# EAGLE design v.0.0.0 (EAGLE 5.11)

## Sheet 1 of 7
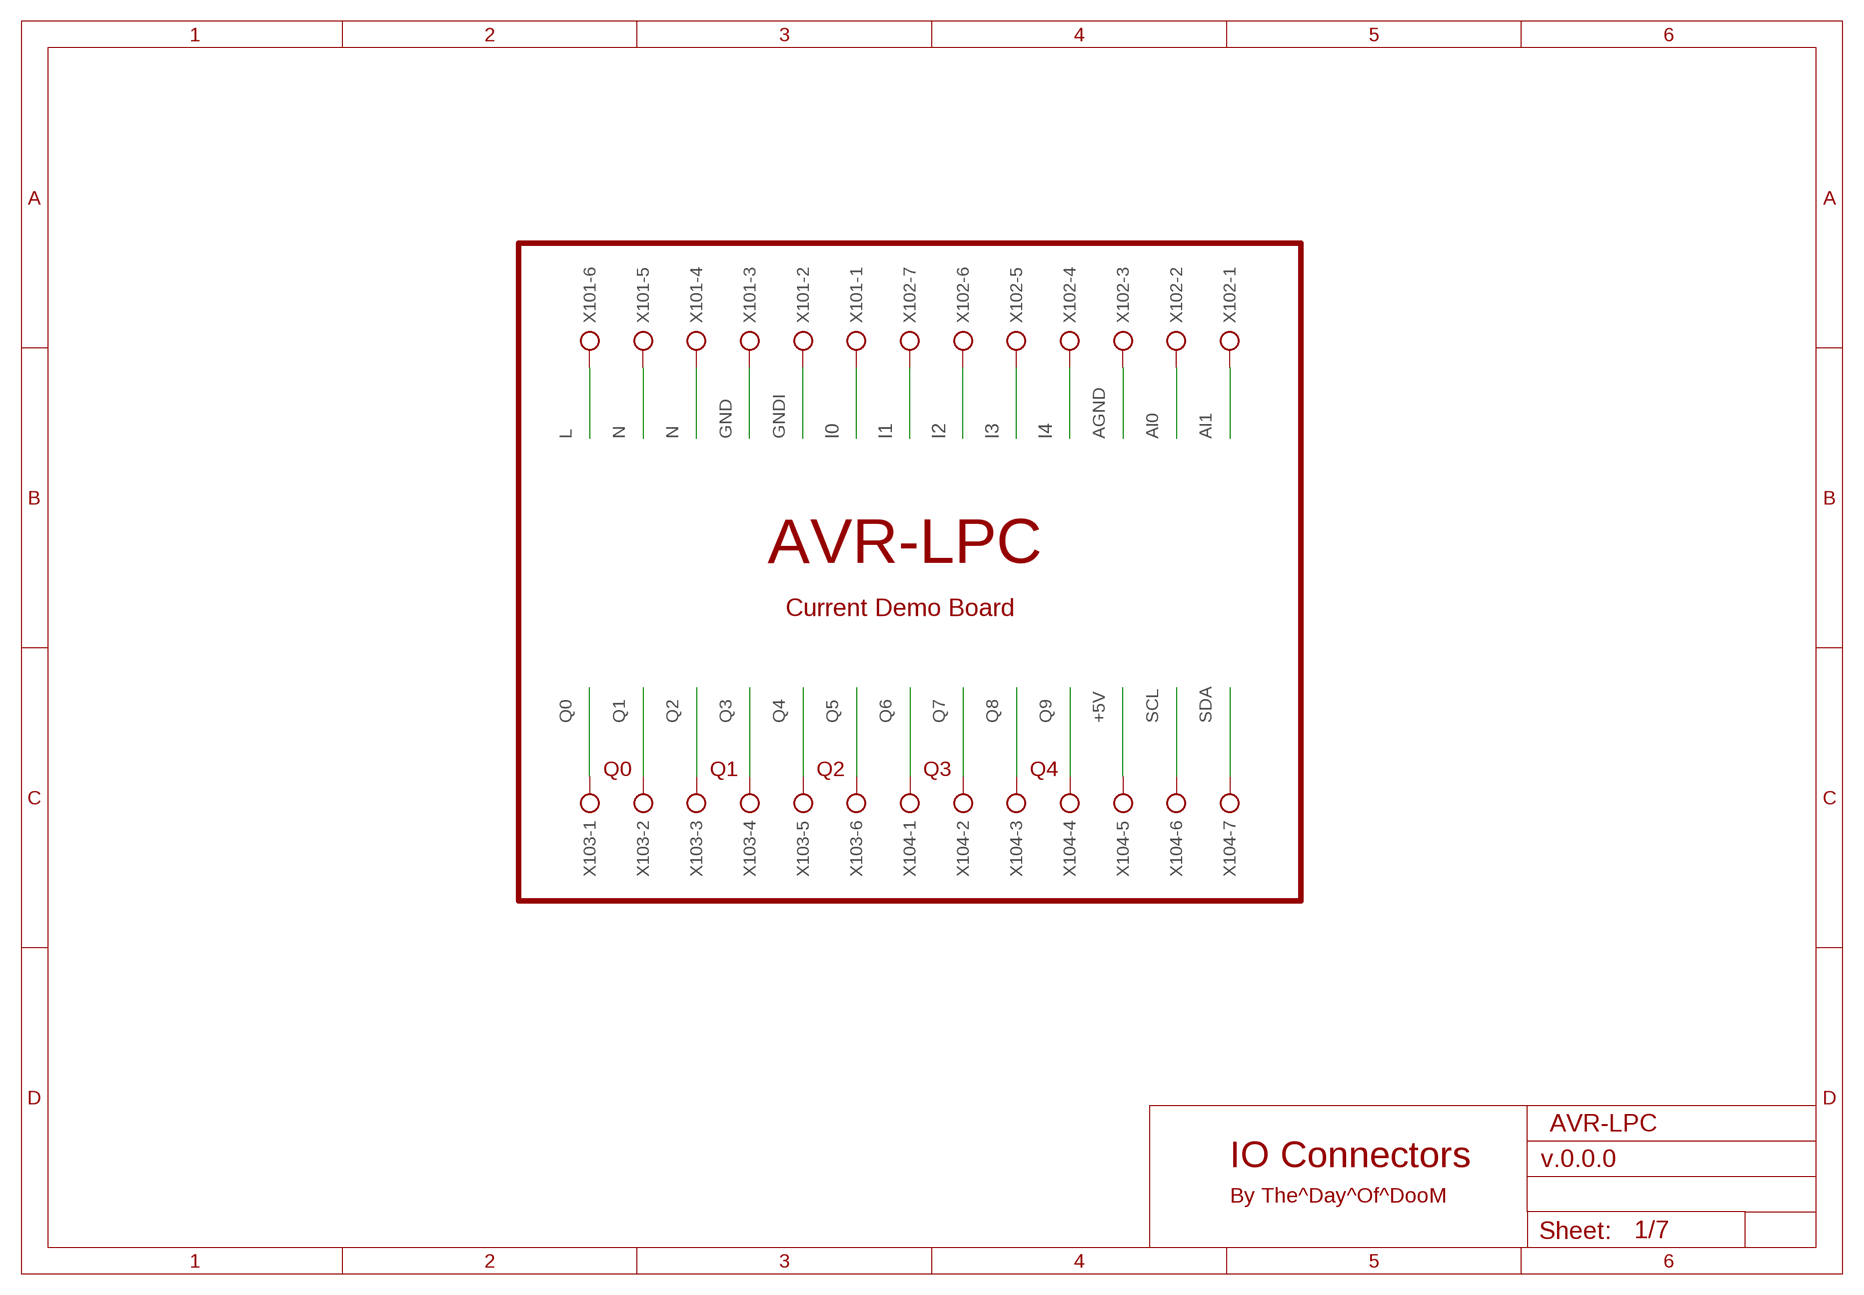
[diagram p0: schematic, sheet 1]

### Parts
X101  AK500/61  [AWG/6-H]
X102  AK500/71  [AWG/7-H]
X103  AK500/61  [AWG/6-H]
X104  AK500/71  [AWG/7-H]

### Nets
+5V: X104.5 ; also sheet 2,3,4,5
AGND: X102.3 ; also sheet 2,7
AI0: X102.2 ; also sheet 7
AI1: X102.1 ; also sheet 7
GND: X101.3 ; also sheet 2,3,4,5,6
GNDI: X101.2 ; also sheet 2,5
I0: X101.1 ; also sheet 5
I1: X102.7 ; also sheet 5
I2: X102.6 ; also sheet 5
I3: X102.5 ; also sheet 5
I4: X102.4 ; also sheet 5
L: X101.6 ; also sheet 2
N: X101.4 X101.5 ; also sheet 2
Q0: X103.1 ; also sheet 6
Q1: X103.2 ; also sheet 6
Q2: X103.3 ; also sheet 6
Q3: X103.4 ; also sheet 6
Q4: X103.5 ; also sheet 6
Q5: X103.6 ; also sheet 6
Q6: X104.1 ; also sheet 6
Q7: X104.2 ; also sheet 6
Q8: X104.3 ; also sheet 6
Q9: X104.4 ; also sheet 6
SCL: X104.6 ; also sheet 3
SDA: X104.7 ; also sheet 3

### Notes on the sheet
- AVR-LPC
- Current Demo Board
- Q0 | Q1 | Q2 | Q3 | Q4
- AVR-LPC
- IO Connectors
- By The^Day^Of^DooM

## Sheet 2 of 7
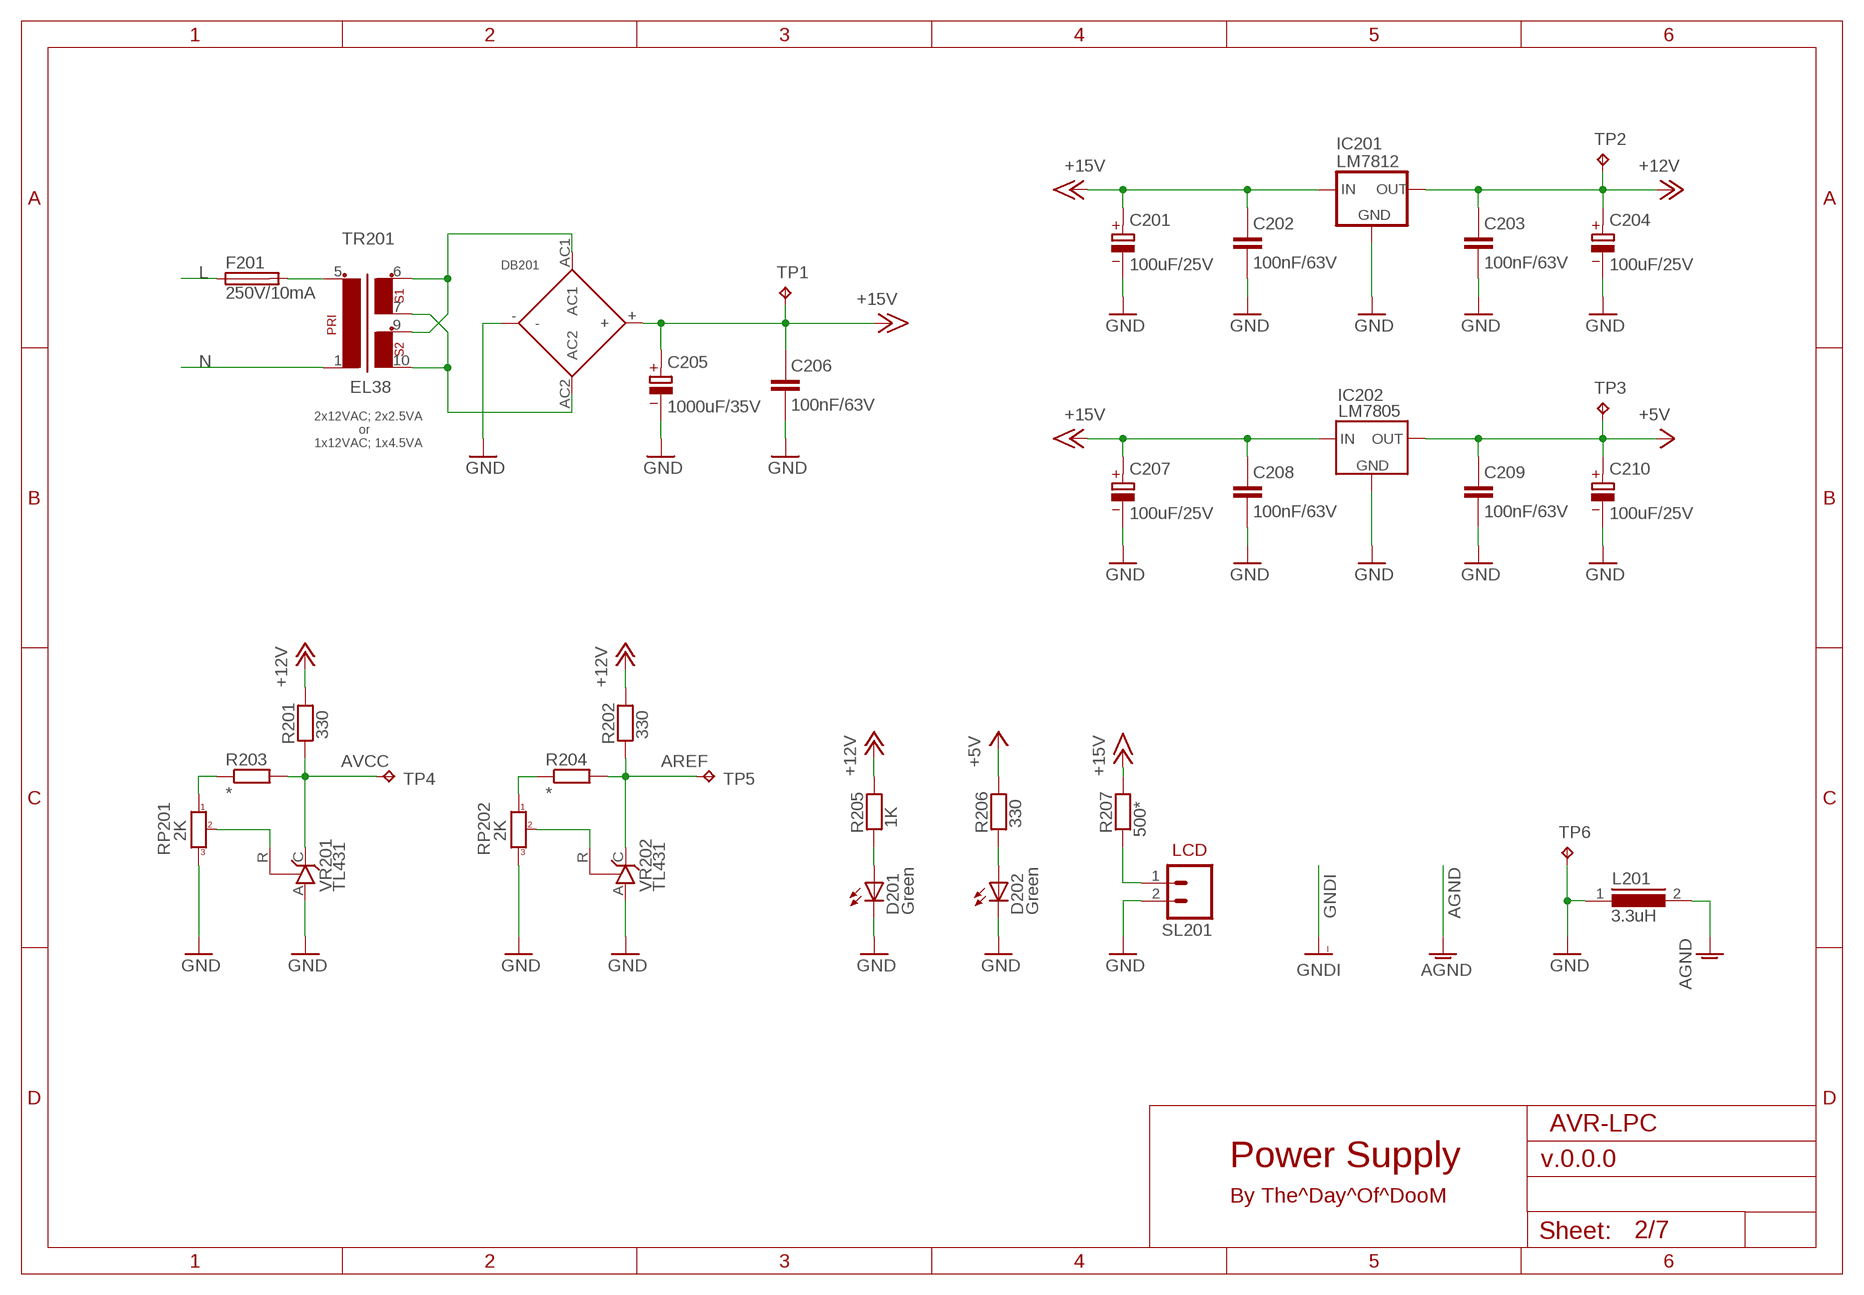
[diagram p1: schematic, sheet 2]

### Parts
C201  100uF/25V  CPOL-EU_Ø250  [CP100X80X24]
C202  100nF/63V  C-EU_2  [C100X86X24]
C203  100nF/63V  C-EU_2  [C100X86X24]
C204  100uF/25V  CPOL-EU_Ø250  [CP100X80X24]
C205  1000uF/35V  CPOL-EU_Ø500Ø400Ø300  [CP500/300X100X24]
C206  100nF/63V  C-EU_3  [C200X100X24]
C207  100uF/25V  CPOL-EU_Ø250  [CP100X80X24]
C208  100nF/63V  C-EU_3  [C200X100X24]
C209  100nF/63V  C-EU_3  [C200X100X24]
C210  100uF/25V  CPOL-EU_Ø250  [CP100X80X24]
D201  Green  LED5MM  [LED5MM]
D202  Green  LED5MM  [LED5MM]
DB201  DB104  [DB104]
F201  250V/10mA  GSH15  [GSH15]
IC201  LM7812  78LXX  [78LXX]
IC202  LM7805  78XXSC1  [78XX_VERTICAL_COOLER]
L201  3.3uH  MICC12  [MICC12]
R201  330  R-EU_2  [R100X86X24]
R202  330  R-EU_2  [R100X86X24]
R203  *  R-EU_M0805  [M0805]
R204  *  R-EU_M0805  [M0805]
R205  1K  R-EU_3  [R200X86X24]
R206  330  R-EU_3  [R200X86X24]
R207  500*  R-EU_11  [R425X86X24]
RP201  2K  RP-EU_  [RP0]
RP202  2K  RP-EU_  [RP0]
SL201  M02  [02P]
TP1  TPPAD1-17  [P1-17]
TP2  TPPAD1-17  [P1-17]
TP3  TPPAD1-17  [P1-17]
TP4  TPPAD1-17  [P1-17]
TP5  TPPAD1-17  [P1-17]
TP6  TPPAD1-17  [P1-17]
TR201  EL38  EI38-2  [EI38-2]
VR201  TL431  TL431CLP  [TO92-CLP]
VR202  TL431  TL431CLP  [TO92-CLP]

### Nets
+5V: C209.P$1 C210.+ IC202.OUT R206.P$2 TP3.TP ; also sheet 1,3,4,5
+12V: C203.P$1 C204.+ IC201.OUT R201.P$2 R202.P$2 R205.P$2 TP2.TP ; also sheet 7
+15V: C201.+ C202.P$1 C205.+ C206.P$1 C207.+ C208.P$1 DB201.+ IC201.IN IC202.IN R207.P$2 TP1.TP ; also sheet 6
AGND: L201.2 ; also sheet 1,7
AREF: R202.P$1 R204.2 TP5.TP VR202.C ; also sheet 3
AVCC: R201.P$1 R203.2 TP4.TP VR201.C ; also sheet 3
GND: C201.- C202.P$2 C203.P$2 C204.- C205.- C206.P$2 C207.- C208.P$2 C209.P$2 C210.- D201.K(C) D202.K(C) DB201.- IC201.GND IC202.GND L201.1 RP201.3 RP202.3 SL201.2 TP6.TP VR201.A VR202.A ; also sheet 1,3,4,5,6
L: F201.1 ; also sheet 1
N: TR201.1 ; also sheet 1
N$1: F201.2 TR201.5
N$3: RP201.2 VR201.R
N$5: RP202.2 VR202.R
N$6: DB201.AC1 TR201.6 TR201.9
N$15: R203.1 RP201.1
N$20: D201.A R205.P$1
N$29: R207.P$1 SL201.1
N$34: D202.A R206.P$1
N$37: DB201.AC2 TR201.7 TR201.10
N$47: R204.1 RP202.1

### Notes on the sheet
- 2x12VAC; 2x2.5VA
- or
- 1x12VAC; 1x4.5VA
- LCD
- AVR-LPC
- Power Supply
- By The^Day^Of^DooM

## Sheet 3 of 7
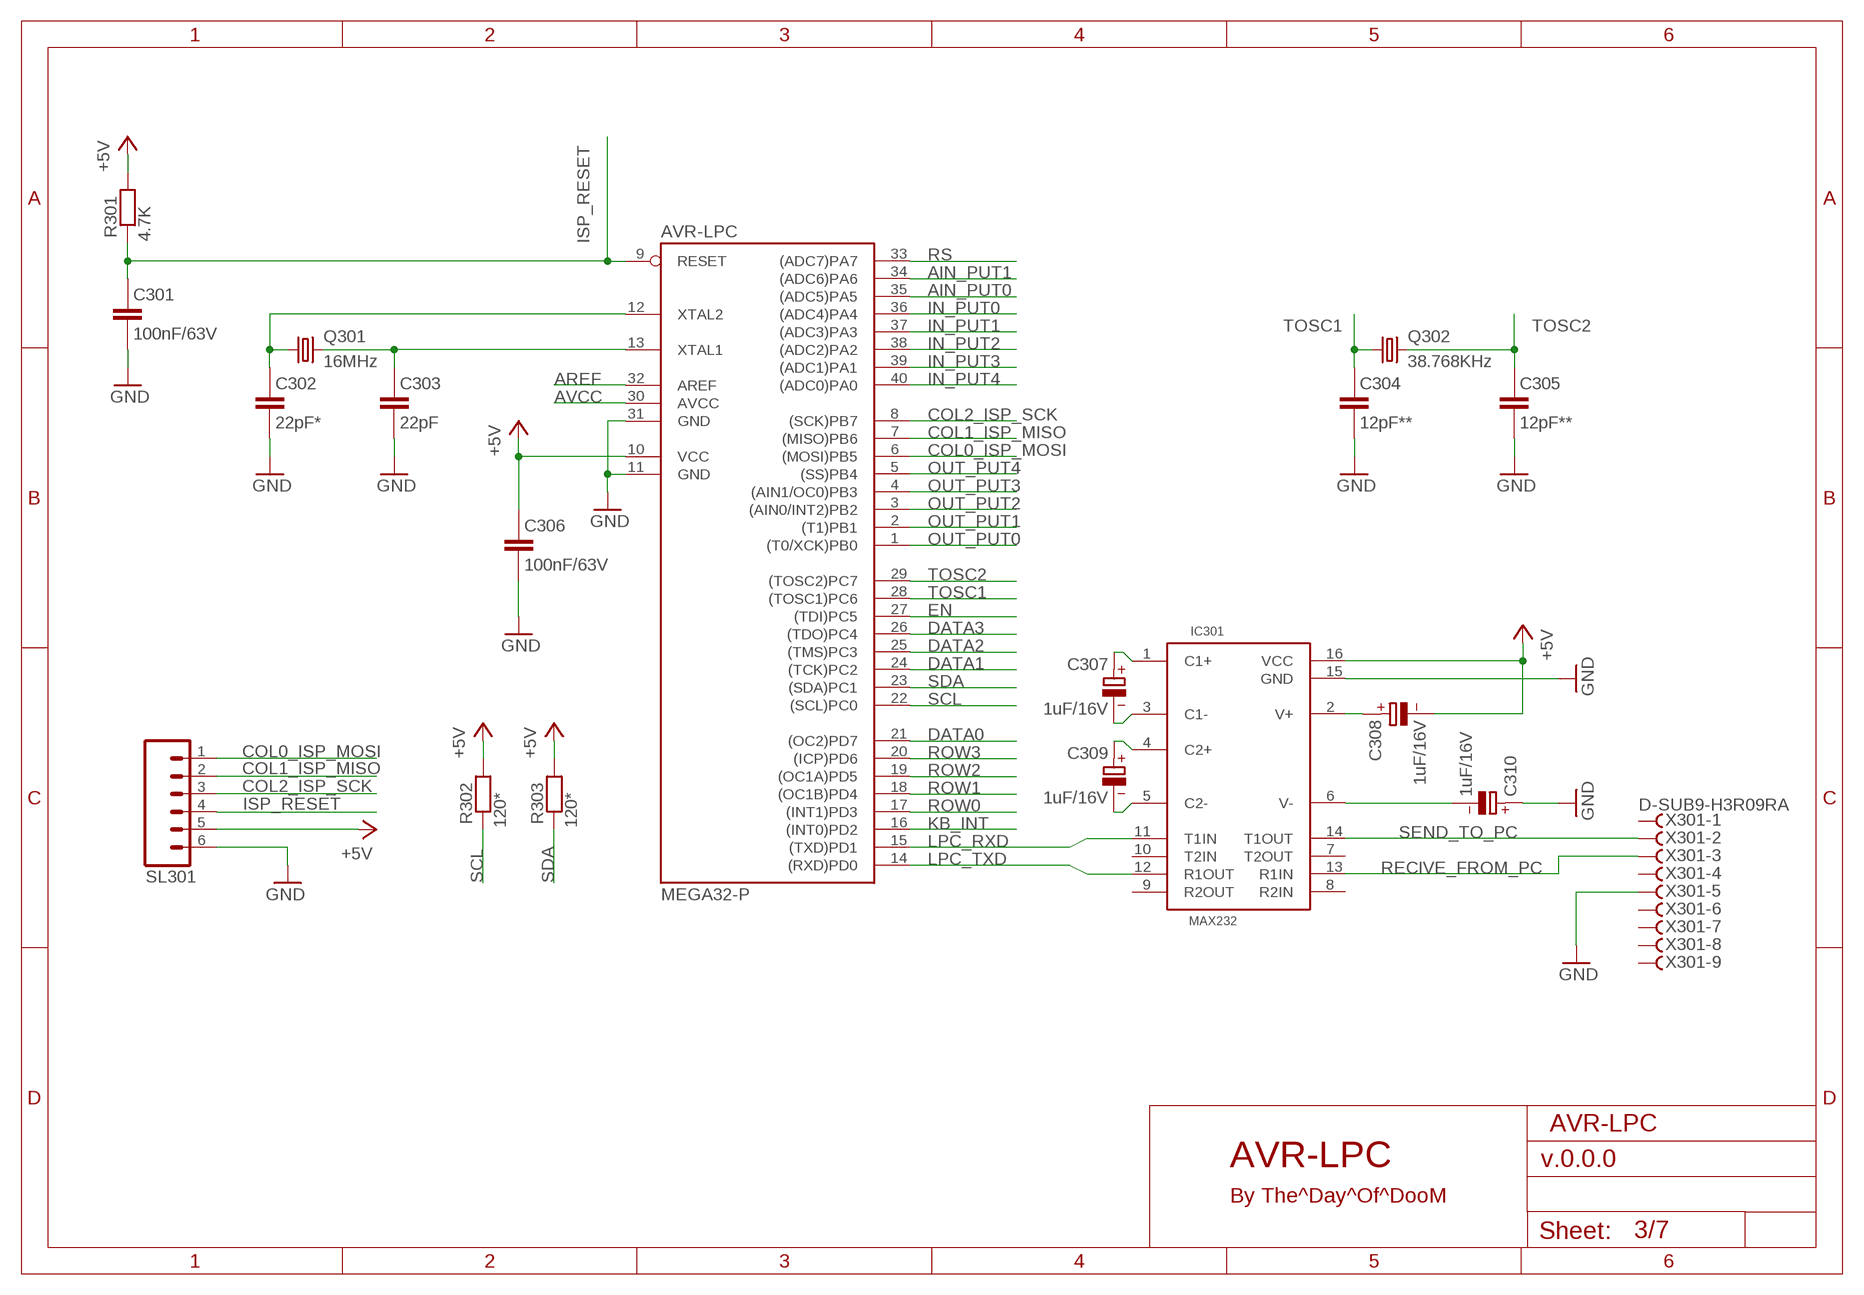
[diagram p2: schematic, sheet 3]

### Parts
AVR-LPC  MEGA32-P  [DIL40]
C301  100nF/63V  C-EU_3  [C200X100X24]
C302  22pF*  C-EU_2  [C100X86X24]
C303  22pF  C-EU_2  [C100X86X24]
C304  12pF**  C-EU_2  [C100X86X24]
C305  12pF**  C-EU_2  [C100X86X24]
C306  100nF/63V  C-EU_3  [C200X100X24]
C307  1uF/16V  CPOL-EU_Ø250  [CP100X80X24]
C308  1uF/16V  CPOL-EU_Ø250  [CP100X80X24]
C309  1uF/16V  CPOL-EU_Ø250  [CP100X80X24]
C310  1uF/16V  CPOL-EU_Ø250  [CP100X80X24]
IC301  MAX232  [DIL16]
Q301  16MHz  CRYSTALHC49U-V  [HC49U-V]
Q302  38.768KHz  CRYSTALTC26V  [TC26V]
R301  4.7K  R-EU_2  [R100X86X24]
R302  120*  R-EU_6  [R400X100X24]
R303  120*  R-EU_6  [R400X100X24]
SL301  M06  [06P]
X301  D-SUB9-H3R09RA  [H3R09RA]

### Nets
+5V: AVR-LPC.10(VCC) C306.P$1 C308.- IC301.16(VCC) R301.P$2 R302.P$2 R303.P$2 SL301.5 ; also sheet 1,2,4,5
AIN_PUT0: AVR-LPC.35((ADC5)PA5) ; also sheet 7
AIN_PUT1: AVR-LPC.34((ADC6)PA6) ; also sheet 7
AREF: AVR-LPC.32(AREF) ; also sheet 2
AVCC: AVR-LPC.30(AVCC) ; also sheet 2
COL0_ISP_MOSI: AVR-LPC.6((MOSI)PB5) SL301.1 ; also sheet 4
COL1_ISP_MISO: AVR-LPC.7((MISO)PB6) SL301.2 ; also sheet 4
COL2_ISP_SCK: AVR-LPC.8((SCK)PB7) SL301.3 ; also sheet 4
DATA0: AVR-LPC.21((OC2)PD7) ; also sheet 4
DATA1: AVR-LPC.24((TCK)PC2) ; also sheet 4
DATA2: AVR-LPC.25((TMS)PC3) ; also sheet 4
DATA3: AVR-LPC.26((TDO)PC4) ; also sheet 4
EN: AVR-LPC.27((TDI)PC5) ; also sheet 4
GND: AVR-LPC.11(GND) AVR-LPC.31(GND) C301.P$2 C302.P$2 C303.P$2 C304.P$2 C305.P$2 C306.P$2 C310.+ IC301.15(GND) SL301.6 X301.5 ; also sheet 1,2,4,5,6
IN_PUT0: AVR-LPC.36((ADC4)PA4) ; also sheet 5
IN_PUT1: AVR-LPC.37((ADC3)PA3) ; also sheet 5
IN_PUT2: AVR-LPC.38((ADC2)PA2) ; also sheet 5
IN_PUT3: AVR-LPC.39((ADC1)PA1) ; also sheet 5
IN_PUT4: AVR-LPC.40((ADC0)PA0) ; also sheet 5
ISP_RESET: AVR-LPC.9(RESET) C301.P$1 R301.P$1 SL301.4
KB_INT: AVR-LPC.16((INT0)PD2) ; also sheet 4
LPC_RXD: AVR-LPC.15((TXD)PD1) IC301.11(T1IN)
LPC_TXD: AVR-LPC.14((RXD)PD0) IC301.12(R1OUT)
N$4: C307.- IC301.3(C1-)
N$9: C307.+ IC301.1(C1+)
N$10: AVR-LPC.12(XTAL2) C302.P$1 Q301.1
N$11: AVR-LPC.13(XTAL1) C303.P$1 Q301.2
N$12: C309.- IC301.5(C2-)
N$13: C309.+ IC301.4(C2+)
N$14: C308.+ IC301.2(V+)
N$19: C310.- IC301.6(V-)
OUT_PUT0: AVR-LPC.1((T0/XCK)PB0) ; also sheet 6
OUT_PUT1: AVR-LPC.2((T1)PB1) ; also sheet 6
OUT_PUT2: AVR-LPC.3((AIN0/INT2)PB2) ; also sheet 6
OUT_PUT3: AVR-LPC.4((AIN1/OC0)PB3) ; also sheet 6
OUT_PUT4: AVR-LPC.5((SS)PB4) ; also sheet 6
RECIVE_FROM_PC: IC301.13(R1IN) X301.3
ROW0: AVR-LPC.17((INT1)PD3) ; also sheet 4
ROW1: AVR-LPC.18((OC1B)PD4) ; also sheet 4
ROW2: AVR-LPC.19((OC1A)PD5) ; also sheet 4
ROW3: AVR-LPC.20((ICP)PD6) ; also sheet 4
RS: AVR-LPC.33((ADC7)PA7) ; also sheet 4
SCL: AVR-LPC.22((SCL)PC0) R302.P$1 ; also sheet 1
SDA: AVR-LPC.23((SDA)PC1) R303.P$1 ; also sheet 1
SEND_TO_PC: IC301.14(T1OUT) X301.2
TOSC1: AVR-LPC.28((TOSC1)PC6) C304.P$1 Q302.1
TOSC2: AVR-LPC.29((TOSC2)PC7) C305.P$1 Q302.2
Unconnected: IC301.7(T2OUT) IC301.8(R2IN) IC301.9(R2OUT) IC301.10(T2IN) X301.1 X301.4 X301.6 X301.7 X301.8 X301.9

### Notes on the sheet
- AVR-LPC
- AVR-LPC
- By The^Day^Of^DooM

## Sheet 4 of 7
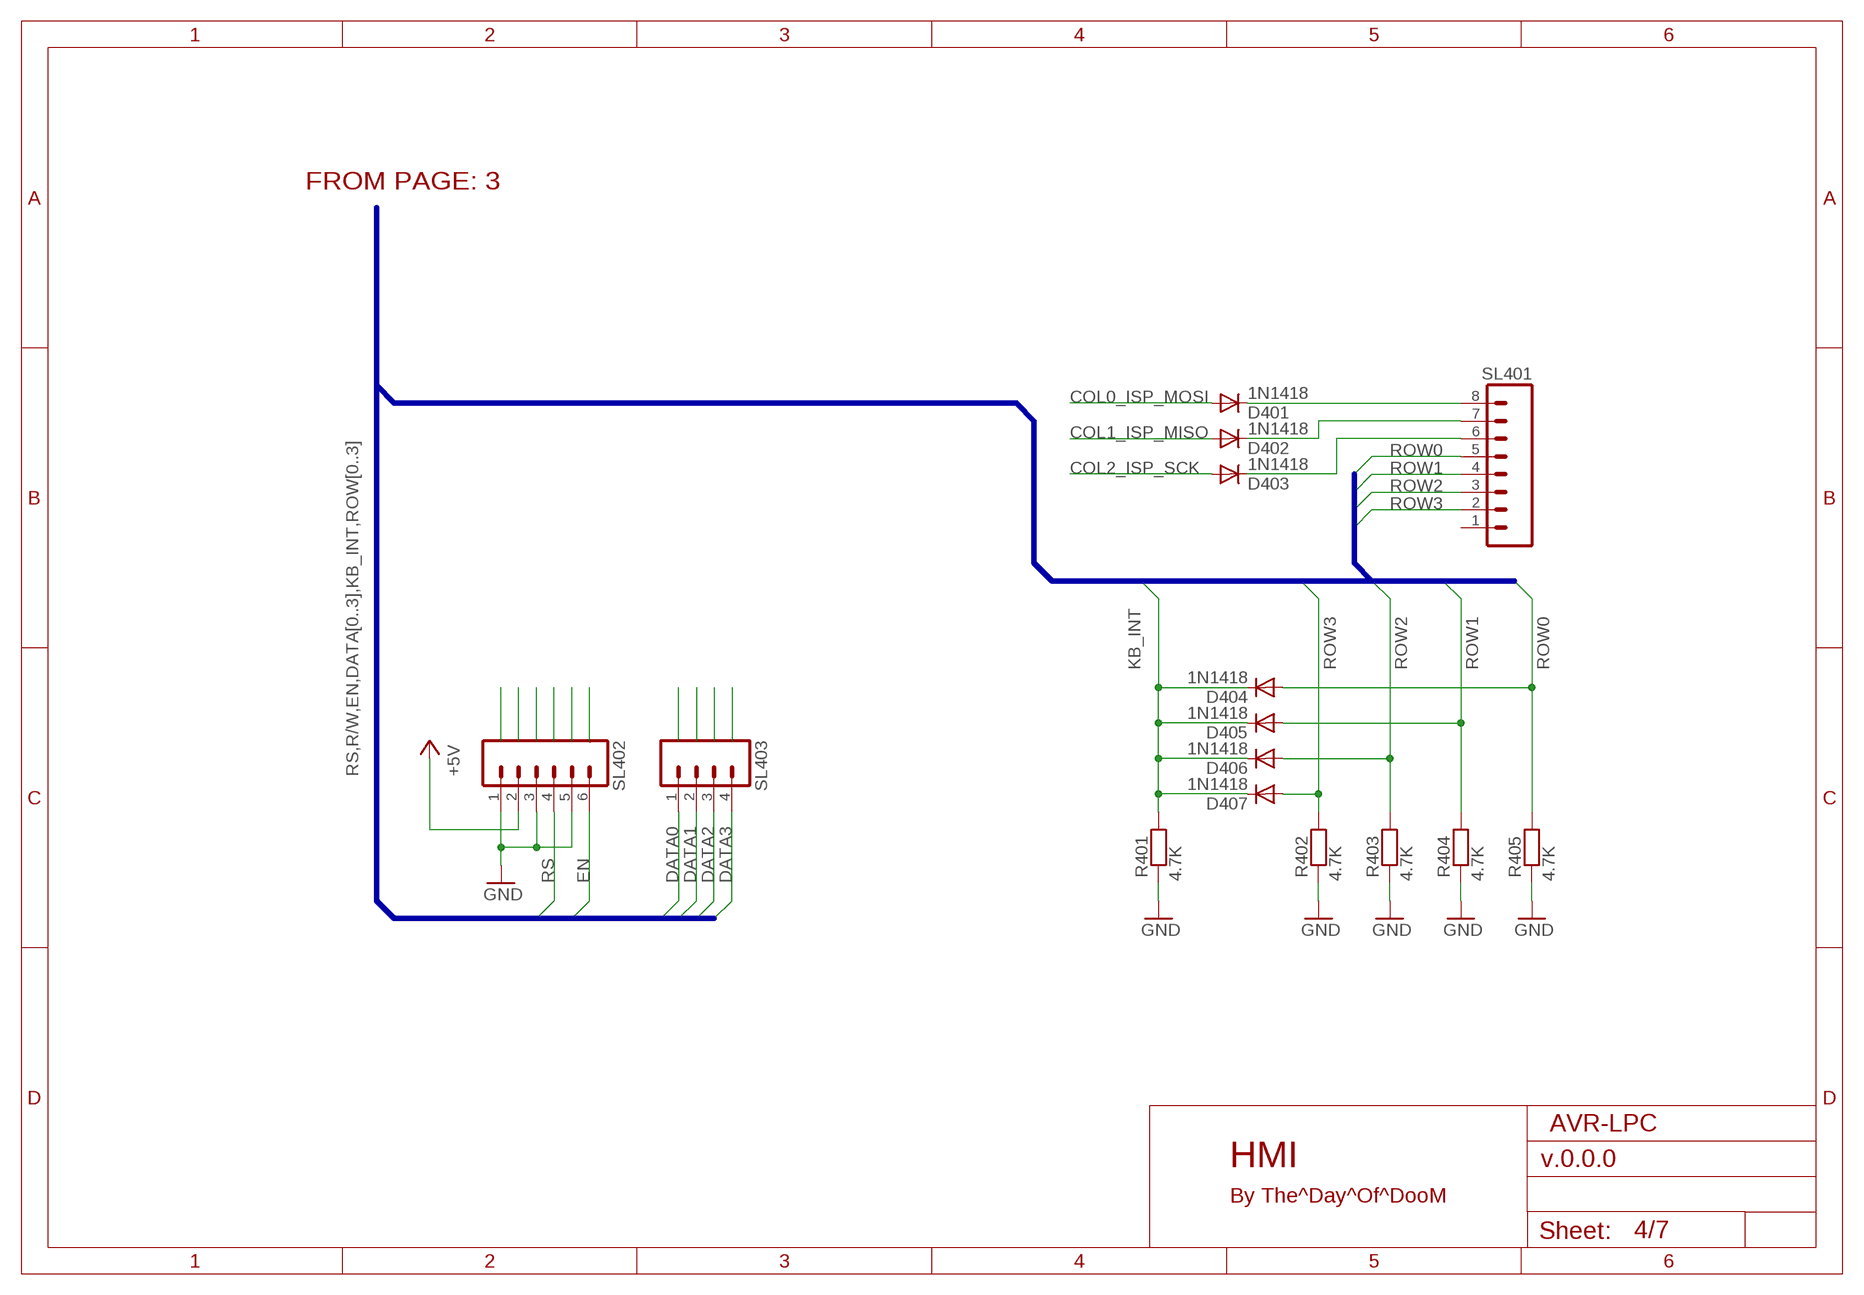
[diagram p3: schematic, sheet 4]

### Parts
D401  1N1418  DIODE-D-5  [D-5]
D402  1N1418  DIODE-D-5  [D-5]
D403  1N1418  DIODE-D-5  [D-5]
D404  1N1418  DIODE-D-2.5  [D-2.5]
D405  1N1418  DIODE-D-2.5  [D-2.5]
D406  1N1418  DIODE-D-2.5  [D-2.5]
D407  1N1418  DIODE-D-2.5  [D-2.5]
R401  4.7K  R-EU_9  [R300X86X24]
R402  4.7K  R-EU_10  [R350X86X24]
R403  4.7K  R-EU_10  [R350X86X24]
R404  4.7K  R-EU_10  [R350X86X24]
R405  4.7K  R-EU_10  [R350X86X24]
SL401  M08  [08P]
SL402  M06  [06P]
SL403  M04  [04P]

### Nets
+5V: SL402.2 ; also sheet 1,2,3,5
COL0_ISP_MOSI: D401.A ; also sheet 3
COL1_ISP_MISO: D402.A ; also sheet 3
COL2_ISP_SCK: D403.A ; also sheet 3
DATA0: SL403.1 ; also sheet 3
DATA1: SL403.2 ; also sheet 3
DATA2: SL403.3 ; also sheet 3
DATA3: SL403.4 ; also sheet 3
EN: SL402.6 ; also sheet 3
GND: R401.P$1 R402.P$1 R403.P$1 R404.P$1 R405.P$1 SL402.1 SL402.3 SL402.5 ; also sheet 1,2,3,5,6
KB_INT: D404.C D405.C D406.C D407.C R401.P$2 ; also sheet 3
N$24: D401.C SL401.8
N$25: D402.C SL401.7
N$28: D403.C SL401.6
ROW0: D404.A R405.P$2 SL401.5 ; also sheet 3
ROW1: D405.A R404.P$2 SL401.4 ; also sheet 3
ROW2: D406.A R403.P$2 SL401.3 ; also sheet 3
ROW3: D407.A R402.P$2 SL401.2 ; also sheet 3
RS: SL402.4 ; also sheet 3
Unconnected: SL401.1

### Buses
RS,R/W,EN,DATA[0..3],KB_INT,ROW[0..3]
KB_INT,ROW[0..3]

### Notes on the sheet
- FROM PAGE: 3
- AVR-LPC
- HMI
- By The^Day^Of^DooM

## Sheet 5 of 7
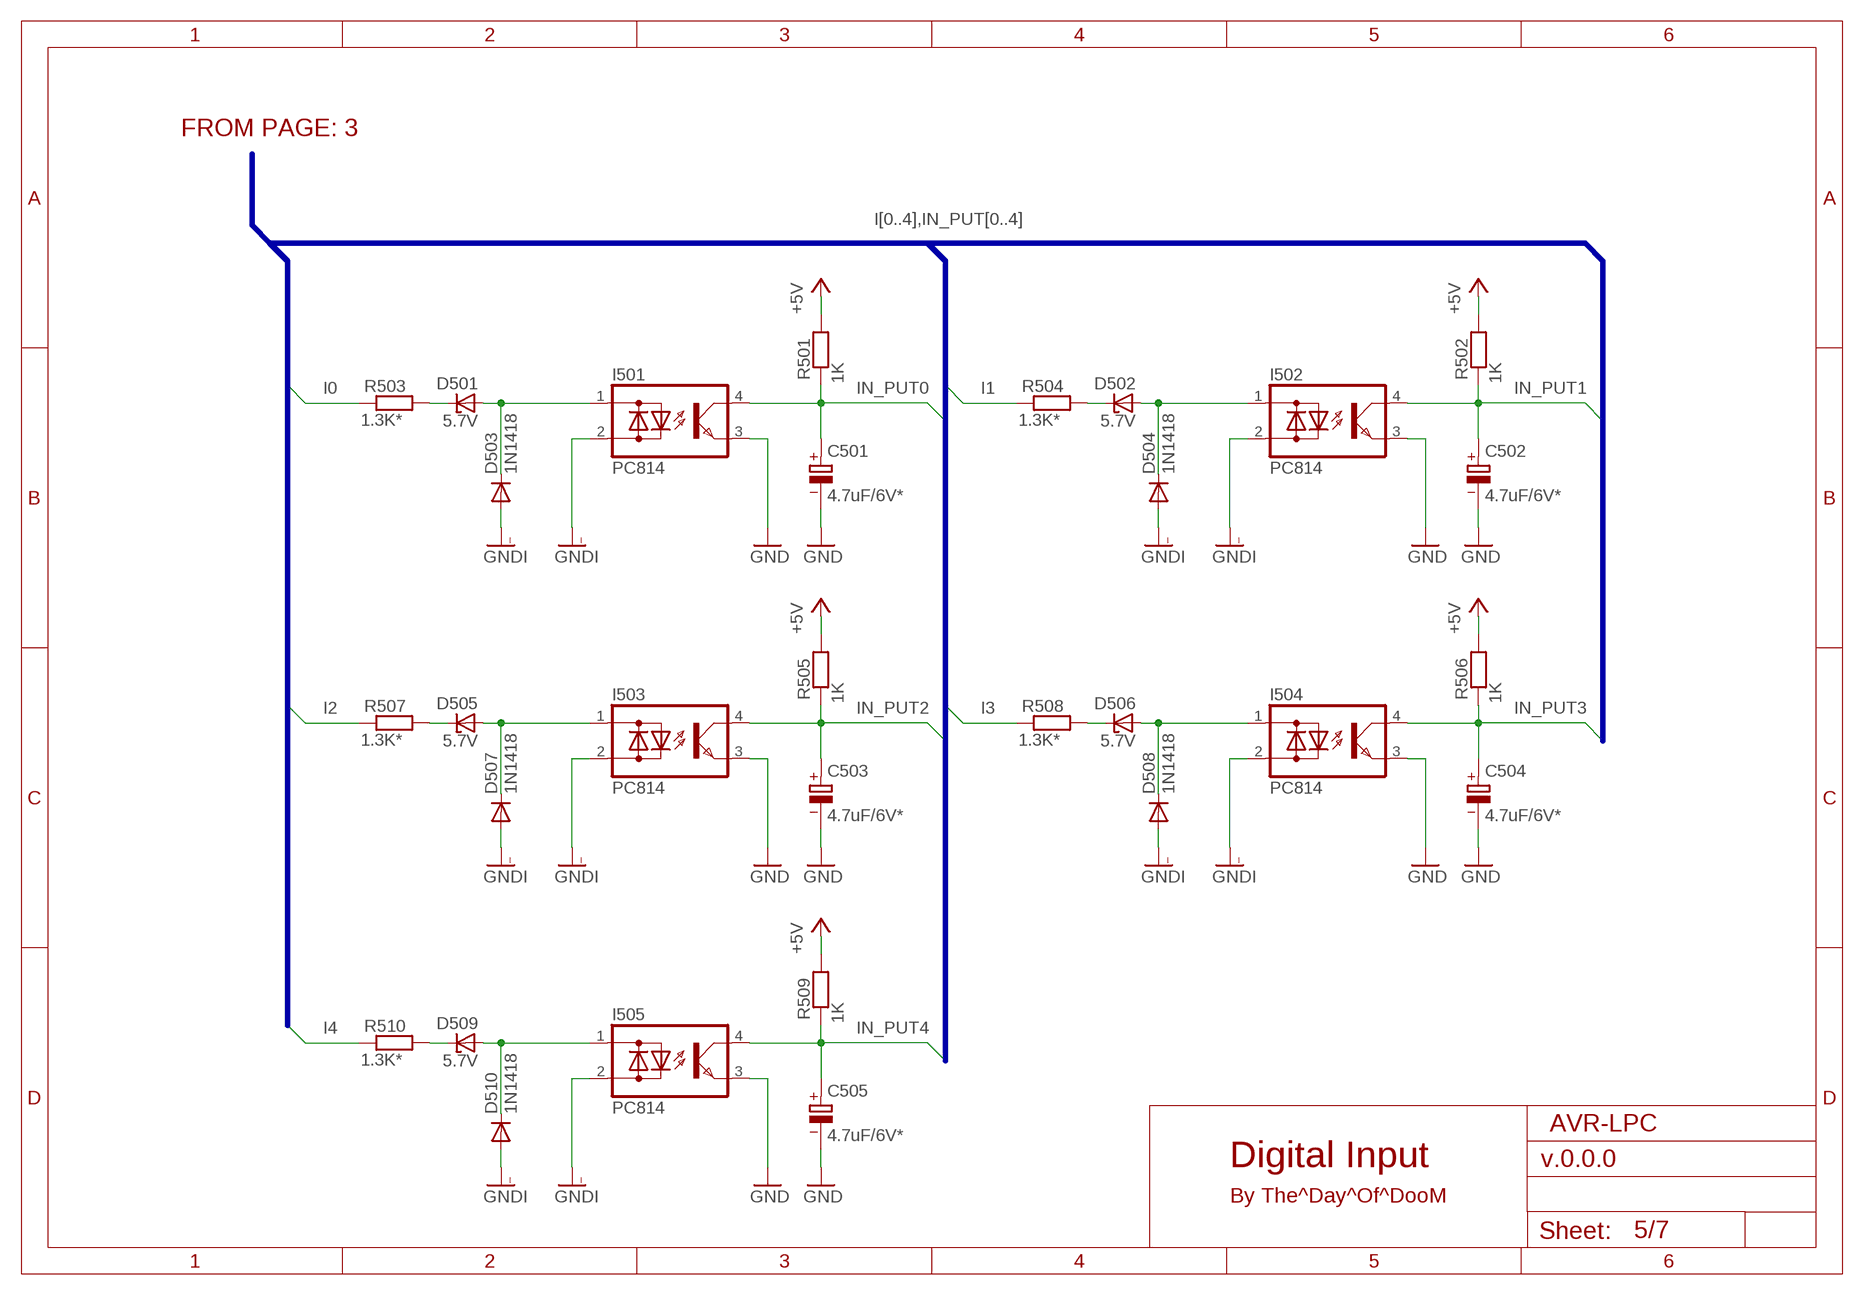
[diagram p4: schematic, sheet 5]

### Parts
C501  4.7uF/6V*  CPOL-EU_Ø250  [CP100X80X24]
C502  4.7uF/6V*  CPOL-EU_Ø250  [CP100X80X24]
C503  4.7uF/6V*  CPOL-EU_Ø250  [CP100X80X24]
C504  4.7uF/6V*  CPOL-EU_Ø250  [CP100X80X24]
C505  4.7uF/6V*  CPOL-EU_Ø250  [CP100X80X24]
D501  5.7V  ZENER-DIODEZD-2.5  [ZDIO-2.5]
D502  5.7V  ZENER-DIODEZD-2.5  [ZDIO-2.5]
D503  1N1418  DIODE-D-2.5  [D-2.5]
D504  1N1418  DIODE-D-2.5  [D-2.5]
D505  5.7V  ZENER-DIODEZD-2.5  [ZDIO-2.5]
D506  5.7V  ZENER-DIODEZD-2.5  [ZDIO-2.5]
D507  1N1418  DIODE-D-2.5  [D-2.5]
D508  1N1418  DIODE-D-2.5  [D-2.5]
D509  5.7V  ZENER-DIODEZD-2.5  [ZDIO-2.5]
D510  1N1418  DIODE-D-2.5  [D-2.5]
I501  PC814  [DIL04]
I502  PC814  [DIL04]
I503  PC814  [DIL04]
I504  PC814  [DIL04]
I505  PC814  [DIL04]
R501  1K  R-EU_11  [R425X86X24]
R502  1K  R-EU_11  [R425X86X24]
R503  1.3K*  R-EU_2  [R100X86X24]
R504  1.3K*  R-EU_2  [R100X86X24]
R505  1K  R-EU_11  [R425X86X24]
R506  1K  R-EU_11  [R425X86X24]
R507  1.3K*  R-EU_2  [R100X86X24]
R508  1.3K*  R-EU_2  [R100X86X24]
R509  1K  R-EU_11  [R425X86X24]
R510  1.3K*  R-EU_2  [R100X86X24]

### Nets
+5V: R501.P$2 R502.P$2 R505.P$2 R506.P$2 R509.P$2 ; also sheet 1,2,3,4
GND: C501.- C502.- C503.- C504.- C505.- I501.3(E) I502.3(E) I503.3(E) I504.3(E) I505.3(E) ; also sheet 1,2,3,4,6
GNDI: D503.A D504.A D507.A D508.A D510.A I501.2(AC2) I502.2(AC2) I503.2(AC2) I504.2(AC2) I505.2(AC2) ; also sheet 1,2
I0: R503.P$1 ; also sheet 1
I1: R504.P$1 ; also sheet 1
I2: R507.P$1 ; also sheet 1
I3: R508.P$1 ; also sheet 1
I4: R510.P$1 ; also sheet 1
IN_PUT0: C501.+ I501.4(C) R501.P$1 ; also sheet 3
IN_PUT1: C502.+ I502.4(C) R502.P$1 ; also sheet 3
IN_PUT2: C503.+ I503.4(C) R505.P$1 ; also sheet 3
IN_PUT3: C504.+ I504.4(C) R506.P$1 ; also sheet 3
IN_PUT4: C505.+ I505.4(C) R509.P$1 ; also sheet 3
N$22: D501.C R503.P$2
N$23: D501.A D503.C I501.1(AC1)
N$26: D505.C R507.P$2
N$27: D505.A D507.C I503.1(AC1)
N$39: D509.C R510.P$2
N$40: D509.A D510.C I505.1(AC1)
N$43: D502.C R504.P$2
N$44: D502.A D504.C I502.1(AC1)
N$51: D506.C R508.P$2
N$52: D506.A D508.C I504.1(AC1)

### Buses
I[0..4],IN_PUT[0..4]

### Notes on the sheet
- FROM PAGE: 3
- AVR-LPC
- Digital Input
- By The^Day^Of^DooM

## Sheet 6 of 7
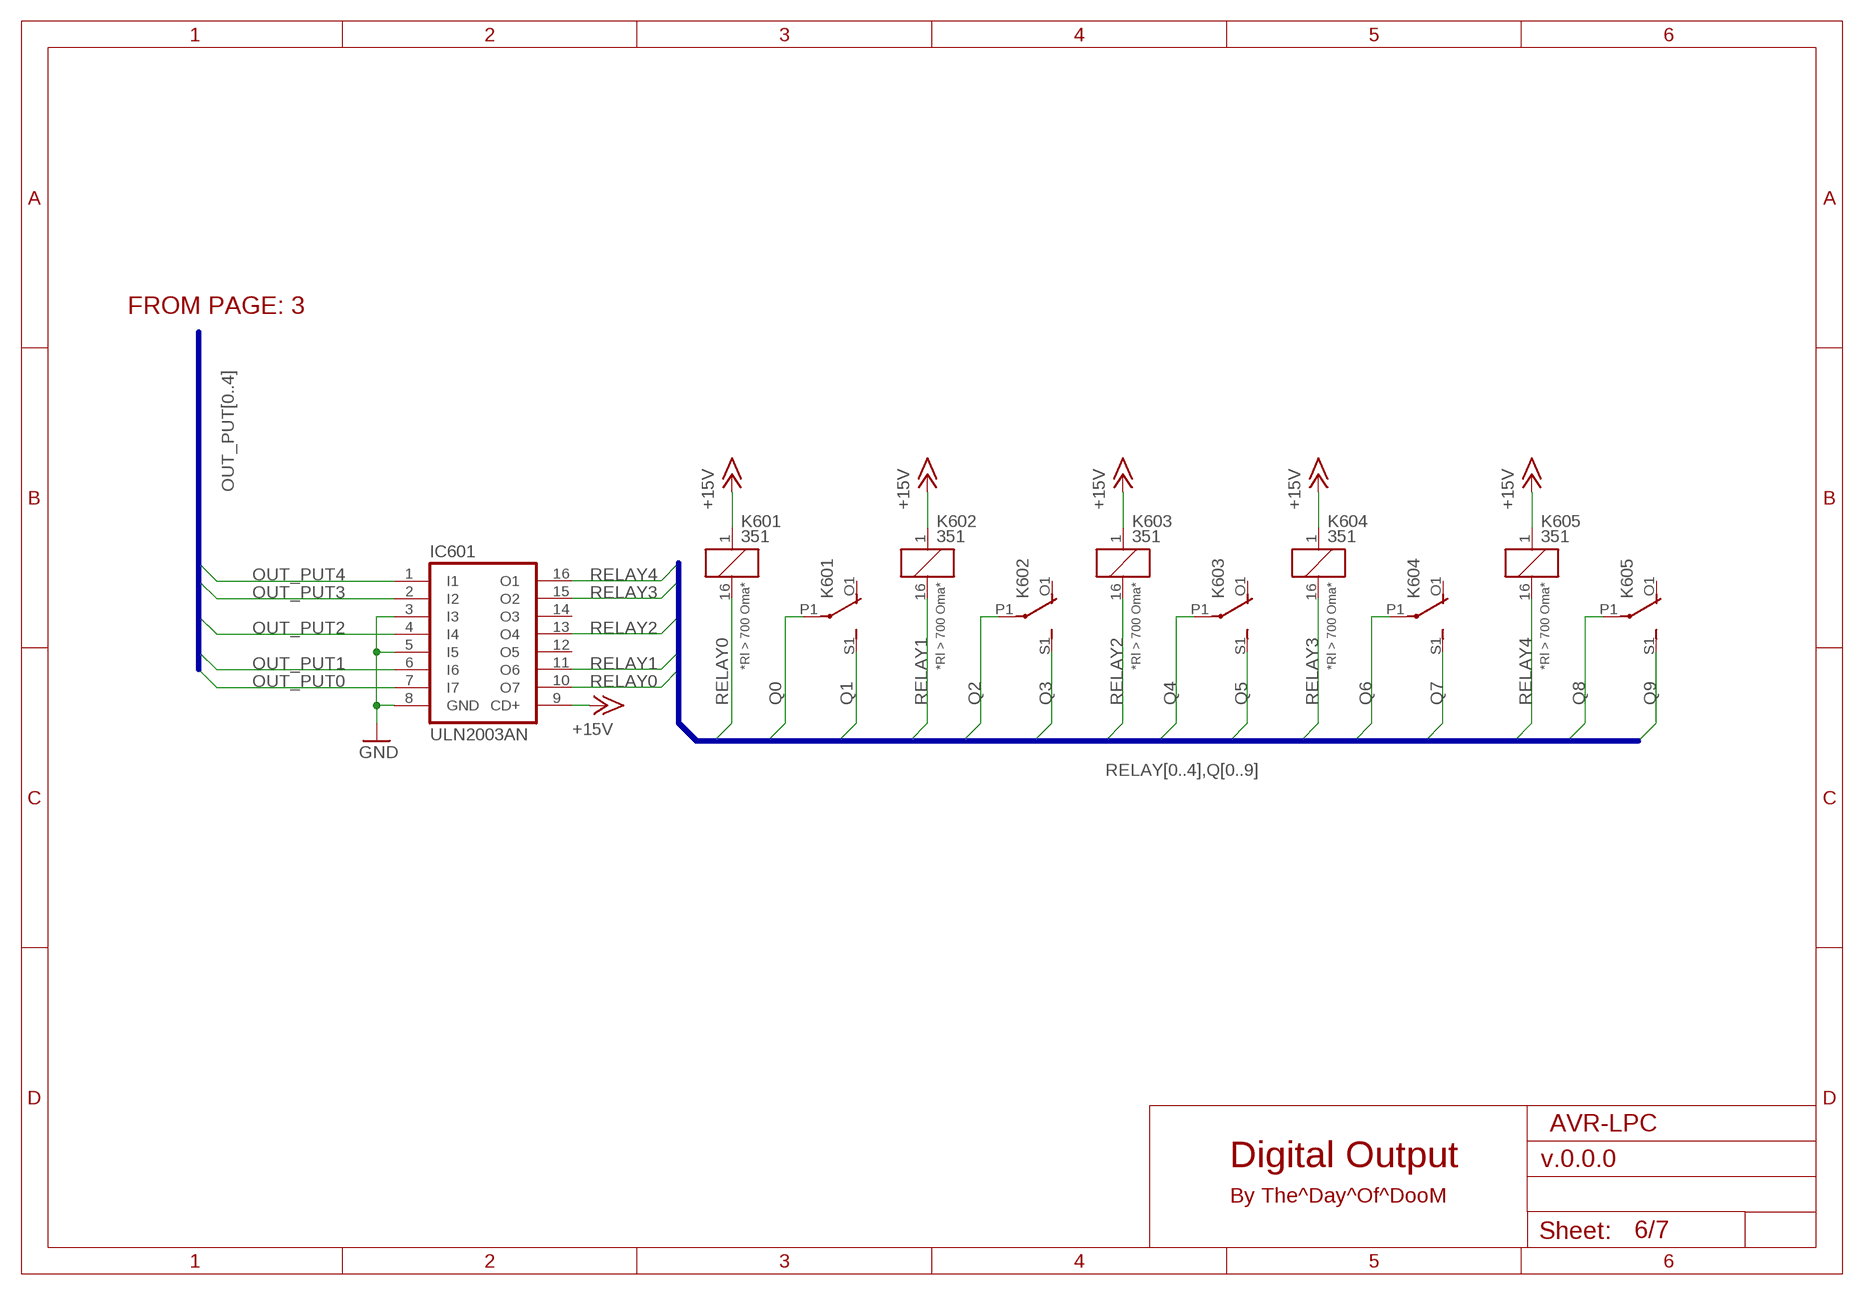
[diagram p5: schematic, sheet 6]

### Parts
IC601  ULN2003AN  [DIL16]
K601  351  [351]
K602  351  [351]
K603  351  [351]
K604  351  [351]
K605  351  [351]

### Nets
+15V: IC601.9(CD+) K601.1 K602.1 K603.1 K604.1 K605.1 ; also sheet 2
GND: IC601.3(I3) IC601.5(I5) IC601.8(GND) ; also sheet 1,2,3,4,5
OUT_PUT0: IC601.7(I7) ; also sheet 3
OUT_PUT1: IC601.6(I6) ; also sheet 3
OUT_PUT2: IC601.4(I4) ; also sheet 3
OUT_PUT3: IC601.2(I2) ; also sheet 3
OUT_PUT4: IC601.1(I1) ; also sheet 3
Q0: K601.P1(2:P) ; also sheet 1
Q1: K601.S1(2:S) ; also sheet 1
Q2: K602.P1(2:P) ; also sheet 1
Q3: K602.S1(2:S) ; also sheet 1
Q4: K603.P1(2:P) ; also sheet 1
Q5: K603.S1(2:S) ; also sheet 1
Q6: K604.P1(2:P) ; also sheet 1
Q7: K604.S1(2:S) ; also sheet 1
Q8: K605.P1(2:P) ; also sheet 1
Q9: K605.S1(2:S) ; also sheet 1
RELAY0: IC601.10(O7) K601.16
RELAY1: IC601.11(O6) K602.16
RELAY2: IC601.13(O4) K603.16
RELAY3: IC601.15(O2) K604.16
RELAY4: IC601.16(O1) K605.16
Unconnected: IC601.12(O5) IC601.14(O3) K601.O1(2:O) K601.O2(3:O) K601.P2(3:P) K601.S2(3:S) K602.O1(2:O) K602.O2(3:O) K602.P2(3:P) K602.S2(3:S) K603.O1(2:O) K603.O2(3:O) K603.P2(3:P) K603.S2(3:S) K604.O1(2:O) K604.O2(3:O) K604.P2(3:P) K604.S2(3:S) K605.O1(2:O) K605.O2(3:O) K605.P2(3:P) K605.S2(3:S)

### Buses
OUT_PUT[0..4]
RELAY[0..4],Q[0..9]

### Notes on the sheet
- FROM PAGE: 3
- *Rl > 700 Oma* | *Rl > 700 Oma* | *Rl > 700 Oma* | *Rl > 700 Oma* | *Rl > 700 Oma*
- AVR-LPC
- Digital Output
- By The^Day^Of^DooM

## Sheet 7 of 7
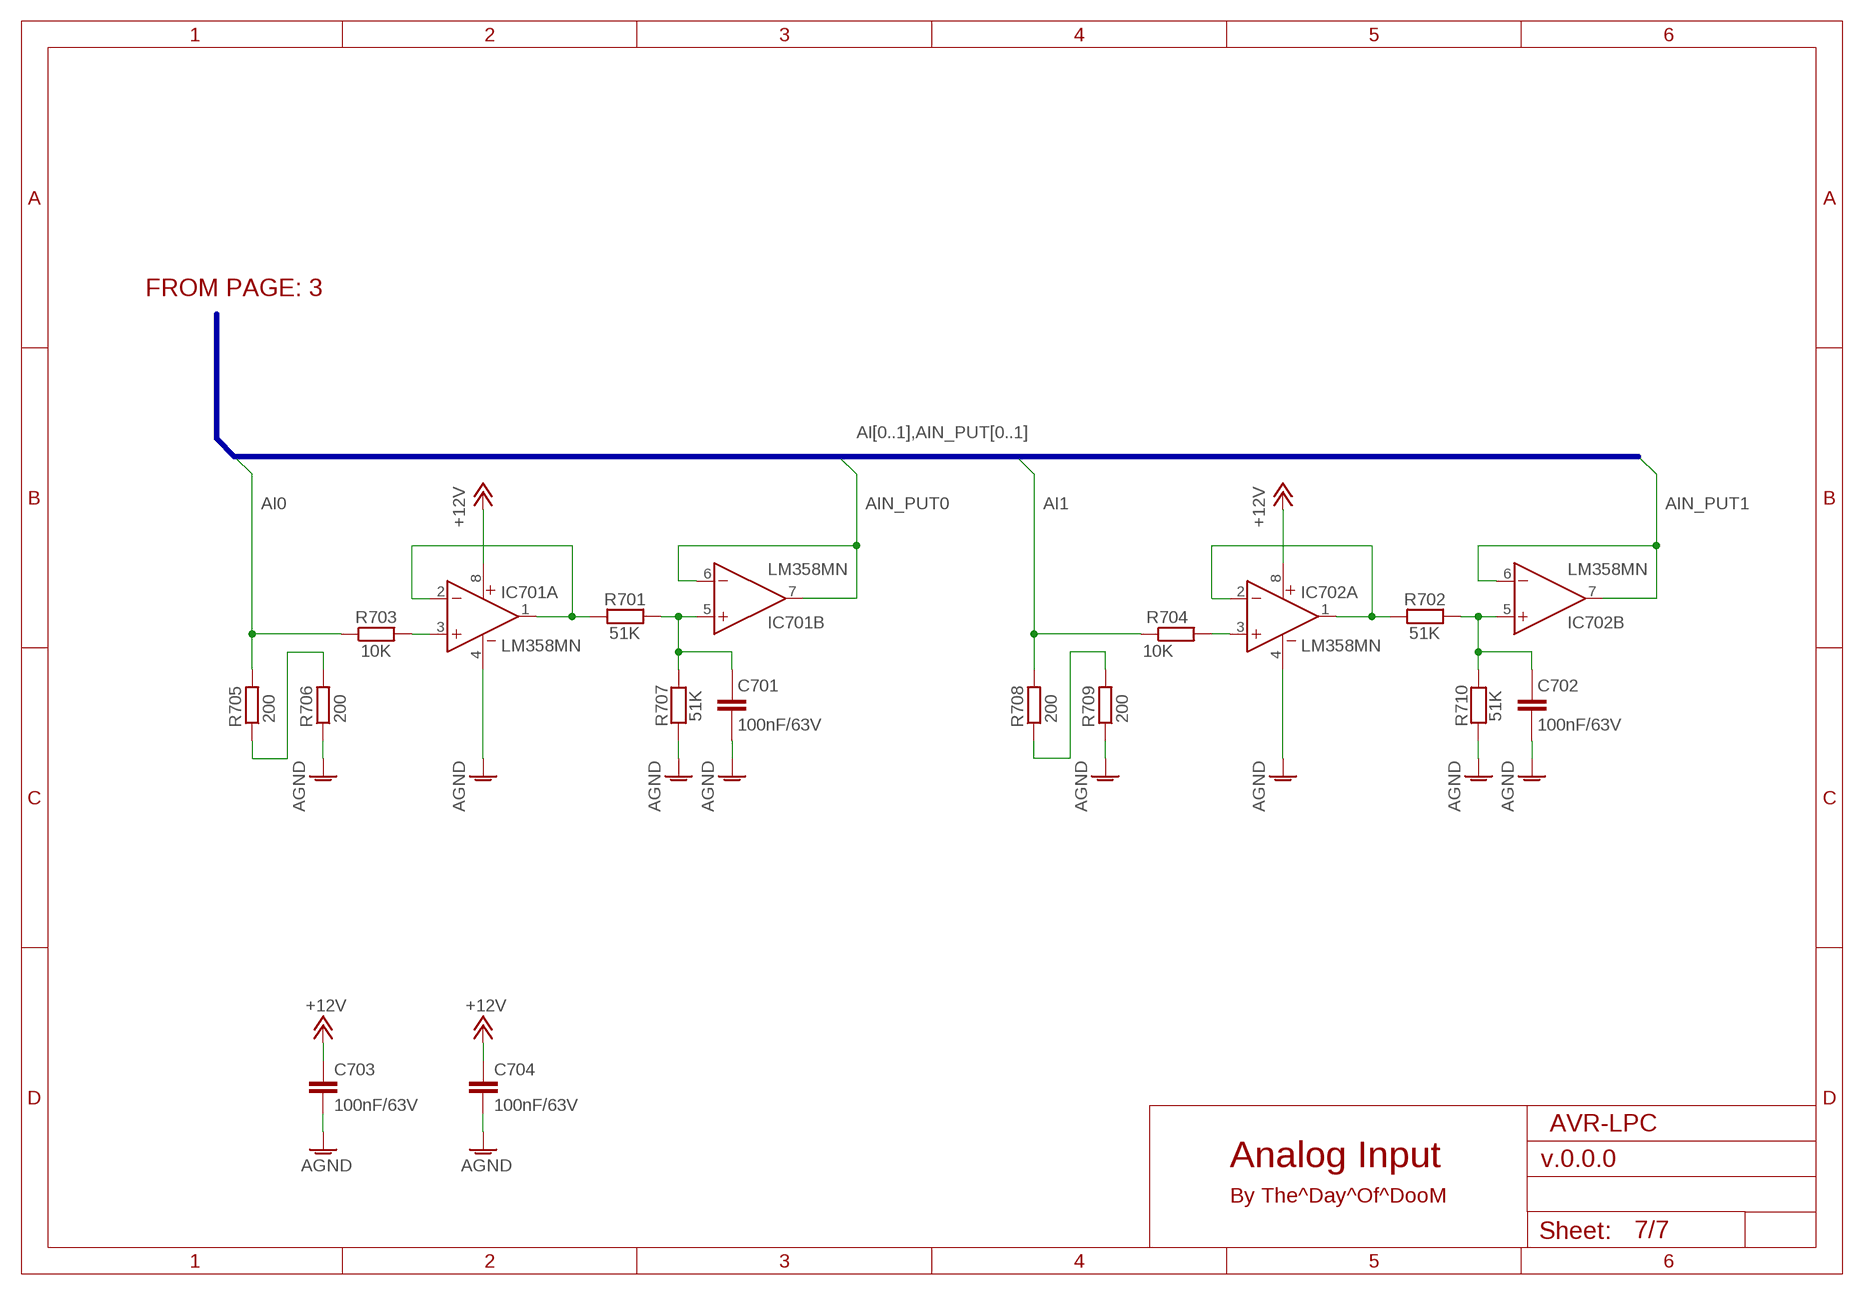
[diagram p6: schematic, sheet 7]

### Parts
C701  100nF/63V  C-EU_3  [C200X100X24]
C702  100nF/63V  C-EU_3  [C200X100X24]
C703  100nF/63V  C-EUC0805  [C0805]
C704  100nF/63V  C-EUC0805  [C0805]
IC701  LM358MN  [DIL8]
IC702  LM358MN  [DIL8]
R701  51K  R-EU_5  [R300X100X24]
R702  51K  R-EU_5  [R300X100X24]
R703  10K  R-EU_M0805  [M0805]
R704  10K  R-EU_M0805  [M0805]
R705  200  R-EU_M0805  [M0805]
R706  200  R-EU_M0805  [M0805]
R707  51K  R-EU_5  [R300X100X24]
R708  200  R-EU_M0805  [M0805]
R709  200  R-EU_M0805  [M0805]
R710  51K  R-EU_5  [R300X100X24]

### Nets
+12V: C703.1 C704.1 IC701.8(A:V+) IC702.8(A:V+) ; also sheet 2
AGND: C701.P$2 C702.P$2 C703.2 C704.2 IC701.4(A:V-) IC702.4(A:V-) R706.1 R707.P$1 R709.1 R710.P$1 ; also sheet 1,2
AI0: R703.1 R705.2 ; also sheet 1
AI1: R704.1 R708.2 ; also sheet 1
AIN_PUT0: IC701.6(B:-IN) IC701.7(B:OUT) ; also sheet 3
AIN_PUT1: IC702.6(B:-IN) IC702.7(B:OUT) ; also sheet 3
N$7: R705.1 R706.2
N$16: IC702.1(A:OUT) IC702.2(A:IN-) R702.P$2
N$21: IC701.3(A:IN+) R703.2
N$38: R708.1 R709.2
N$41: C701.P$1 IC701.5(B:IN+) R701.P$1 R707.P$2
N$42: IC701.1(A:OUT) IC701.2(A:IN-) R701.P$2
N$45: C702.P$1 IC702.5(B:IN+) R702.P$1 R710.P$2
N$48: IC702.3(A:IN+) R704.2

### Buses
AI[0..1],AIN_PUT[0..1]

### Notes on the sheet
- FROM PAGE: 3
- AVR-LPC
- Analog Input
- By The^Day^Of^DooM

## Library data of the parts
AVR-LPC = atmel:MEGA32-P: MICROCONTROLLER 32 Kbytes FLASH 2 Kbytes SRAM 1 Kbytes EEPROM USART 8-channel 10 bit ADC Source: www.atmel.com .. doc2503.pdf
C201 C204 C205 C207 C210 C307-C310 C501-C505 = myRcl:CPOL-EU_
C202 C203 C206 C208 C209 C301-C306 C701 C702 = myRcl:C-EU_: CAPACITOR, European symbol
C703 C704 = rcl:C-EU: CAPACITOR, European symbol
D201 D202 = LED:LED: LED OSRAM: - CHIPLED LG R971, LG N971, LY N971, LG Q971, LY Q971, LO R971, LY R971 LH N974, LH R974 LS Q976, LO Q976, LY Q976 LO Q996 - Hyper CHIPLED LW Q18S LB Q993, LB Q99A, LB R99A - SideLED LS A670, LO A670, LY A670, LG A670, LP A670 LB A673, LV A673, LT A673, LW A673 LH A674 LY A675 LS A676, LA A676, LO A676, LY A676, LW A676 LS A679, LY A679, LG A679 - Hyper Micro SIDELED® LS Y876, LA Y876, LO Y876, LY Y876 LT Y87S - SmartLED LW L88C, LW L88S LB L89C, LB L89S, LG L890 LS L89K, LO L89K, LY L89K LS L896, LA L896, LO L896, LY L896 - TOPLED LS T670, LO T670, LY T670, LG T670, LP T670 LSG T670, LSP T670, LSY T670, LOP T670, LYG T670 LG T671, LOG T671, LSG T671 LB T673, LV T673, LT T673, LW T673 LH T674 LS T676, LA T676, LO T676, LY T676, LB T676, LH T676, LSB T676, LW T676 LB T67C, LV T67C, LT T67C, LS T67K, LO T67K, LY T67K, LW E67C LS E67B, LA E67B, LO E67B, LY E67B, LB E67C, LV E67C, LT E67C LW T67C LS T679, LY T679, LG T679 LS T770, LO T770, LY T770, LG T770, LP T770 LB T773, LV T773, LT T773, LW T773 LH T774 LS E675, LA E675, LY E675, LS T675 LS T776, LA T776, LO T776, LY T776, LB T776 LHGB T686 LT T68C, LB T68C - Hyper Mini TOPLED® LB M676 - Mini TOPLED Santana® LG M470 LS M47K, LO M47K, LY M47K Source: http://www.osram.convergy.de LUXEON: - LUMILED® LXK2-PW12-R00, LXK2-PW12-S00, LXK2-PW14-U00, LXK2-PW14-V00 LXK2-PM12-R00, LXK2-PM12-S00, LXK2-PM14-U00 LXK2-PE12-Q00, LXK2-PE12-R00, LXK2-PE12-S00, LXK2-PE14-T00, LXK2-PE14-U00 LXK2-PB12-K00, LXK2-PB12-L00, LXK2-PB12-M00, LXK2-PB14-N00, LXK2-PB14-P00, LXK2-PB14-Q00 LXK2-PR12-L00, LXK2-PR12-M00, LXK2-PR14-Q00, LXK2-PR14-R00 LXK2-PD12-Q00, LXK2-PD12-R00, LXK2-PD12-S00 LXK2-PH12-R00, LXK2-PH12-S00 LXK2-PL12-P00, LXK2-PL12-Q00, LXK2-PL12-R00 Source: www.luxeon.com KINGBRIGHT: KA-3528ASYC Source: www.kingbright.com
D401-D407 D503 D504 D507 D508 D510 = diode:DIODE-: DIODE
D501 D502 D505 D506 D509 = diode:ZENER-DIODE: Z-Diode
DB201 = diode:DB104
F201 = fuse:GSH15: FUSE HOLDER grid 15mm, 19649 Wickmann
I501-I505 = optocoupler:PC814: SHARP OPTO COUPLER
IC201 = v-reg:78LXX: VOLTAGE REGULATOR
IC202 = myV-reg:78XXSC: VOLTAGE REGULATOR
IC301 = myMaxim:MAX232
IC601 = uln-udn:ULN2003A: DRIVER ARRAY
IC701 IC702 = myLinear:LM358M
K601-K605 = relay:351: RELAY 2 x switch, Omron
L201 = inductors:MICC12: INDUCTOR
Q301 Q302 = crystal:CRYSTAL: CRYSTAL
R201 R202 R205-R207 R301-R303 R401-R405 R501-R510 R701 R702 R707 R710 = myRcl:R-EU_: RESISTOR, European symbol
R203 R204 R703-R706 R708 R709 = rcl:R-EU_: RESISTOR, European symbol
RP201 RP202 = myRcl:RP-EU_
SL201 = con-amp-quick:M02: AMP QUICK CONNECTOR
SL301 SL402 = con-amp-quick:M06: AMP QUICK CONNECTOR
SL401 = con-amp-quick:M08: AMP QUICK CONNECTOR
SL403 = con-amp-quick:M04: AMP QUICK CONNECTOR
TP1-TP6 = testpad:TP: Test pad
TR201 = trafo:EI38-2: TRANSFORMER 1 primary winding, 2 secondary windings ERA
VR201 VR202 = v-reg:TL431CLP: VOLTAGE REGULATOR
X101 X103 = con-ptr500:AK500/6: CONNECTOR
X102 X104 = con-ptr500:AK500/7: CONNECTOR
X301 = con-thomas-betts:D-SUB9-: D-Subminiatur Connector Source: Electronioc Interconnects European Edition 1998

## Board
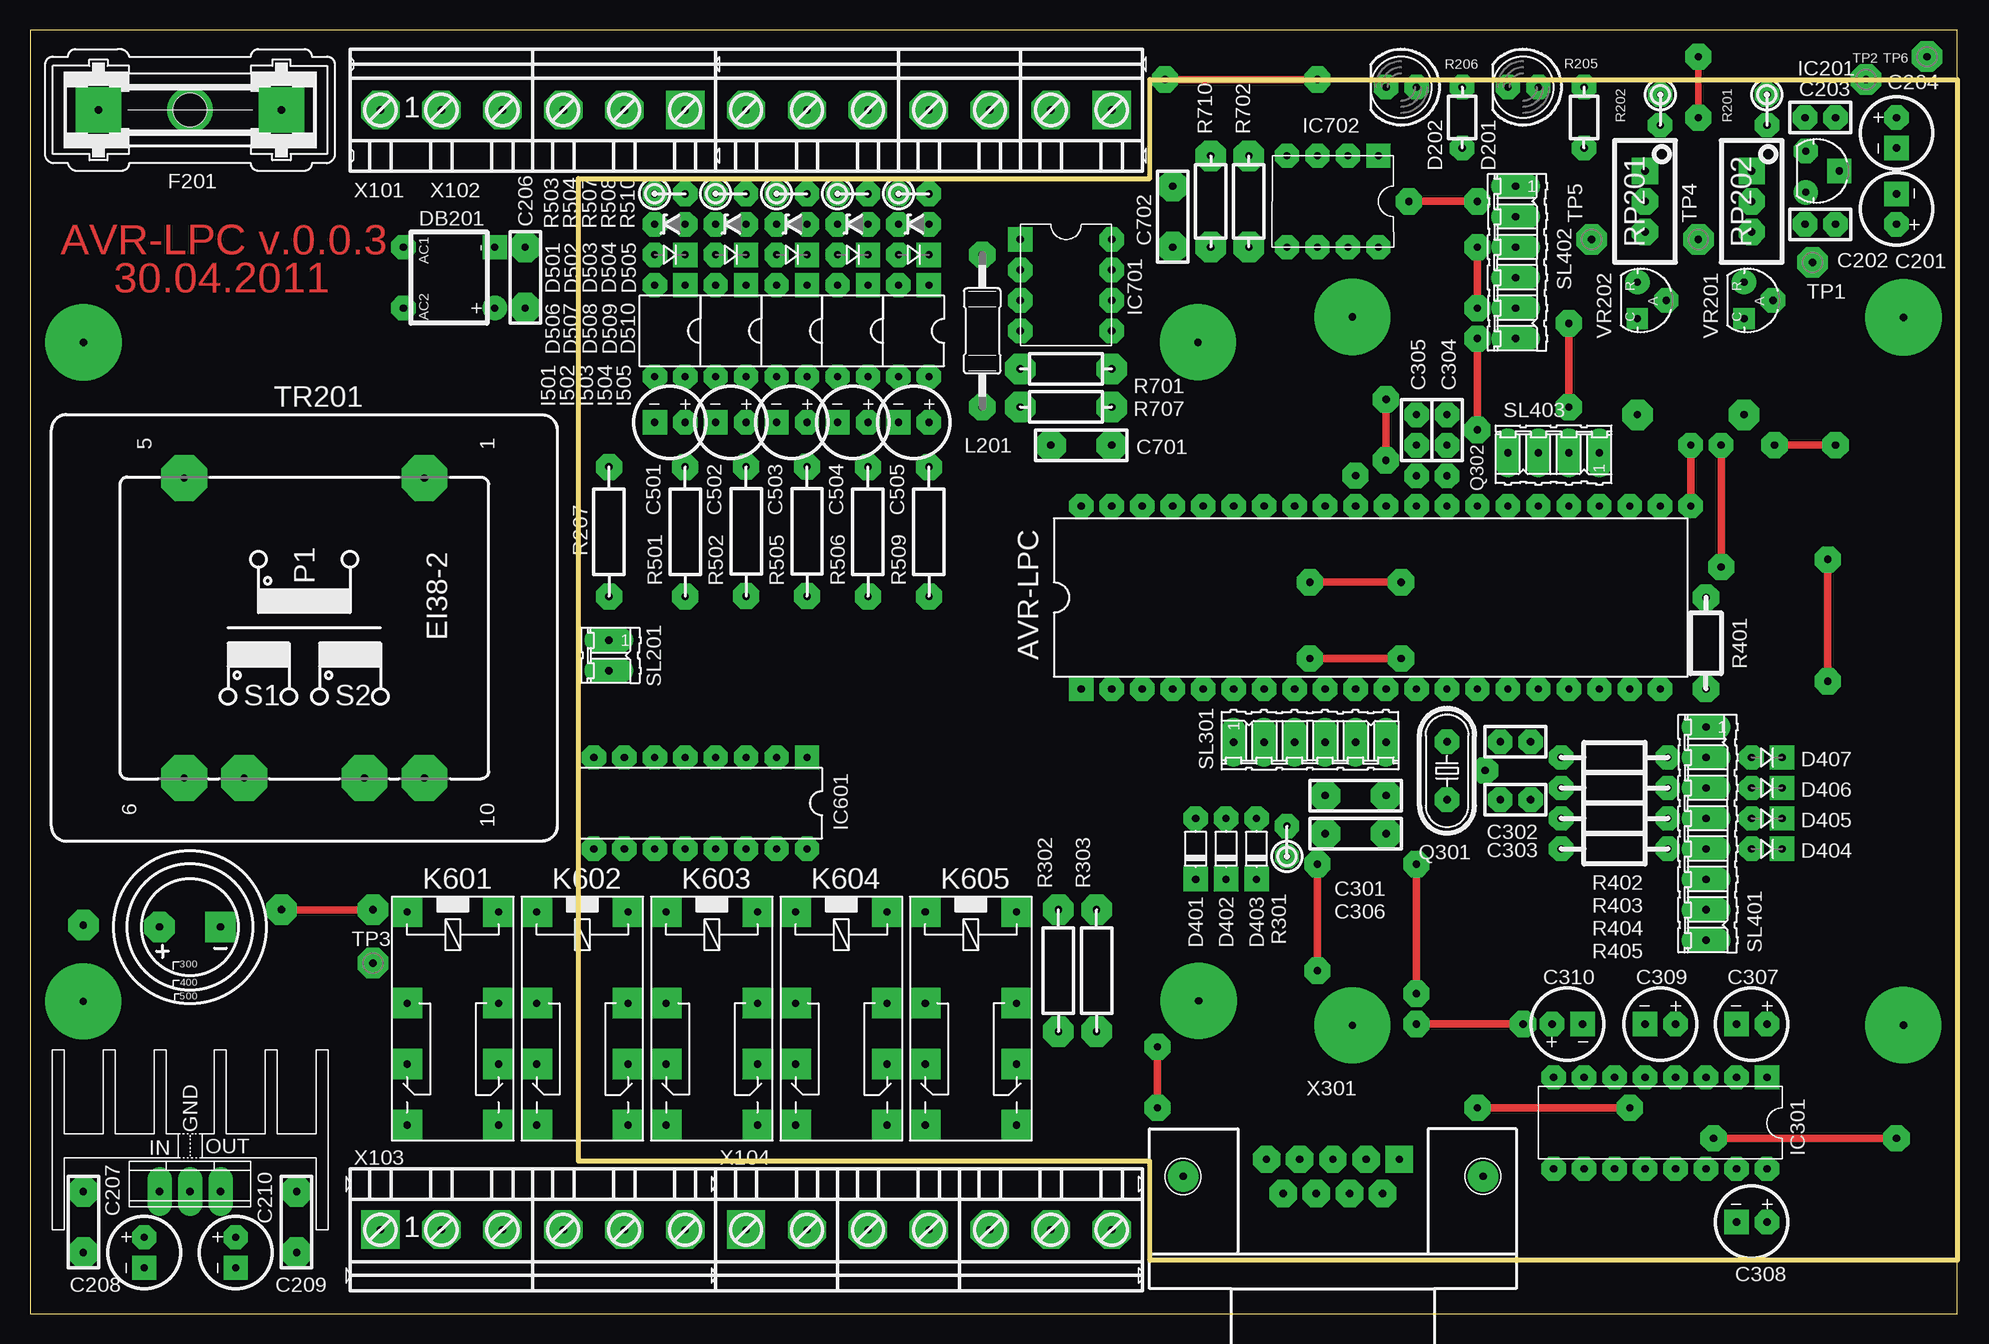
[diagram p7: board, top side]
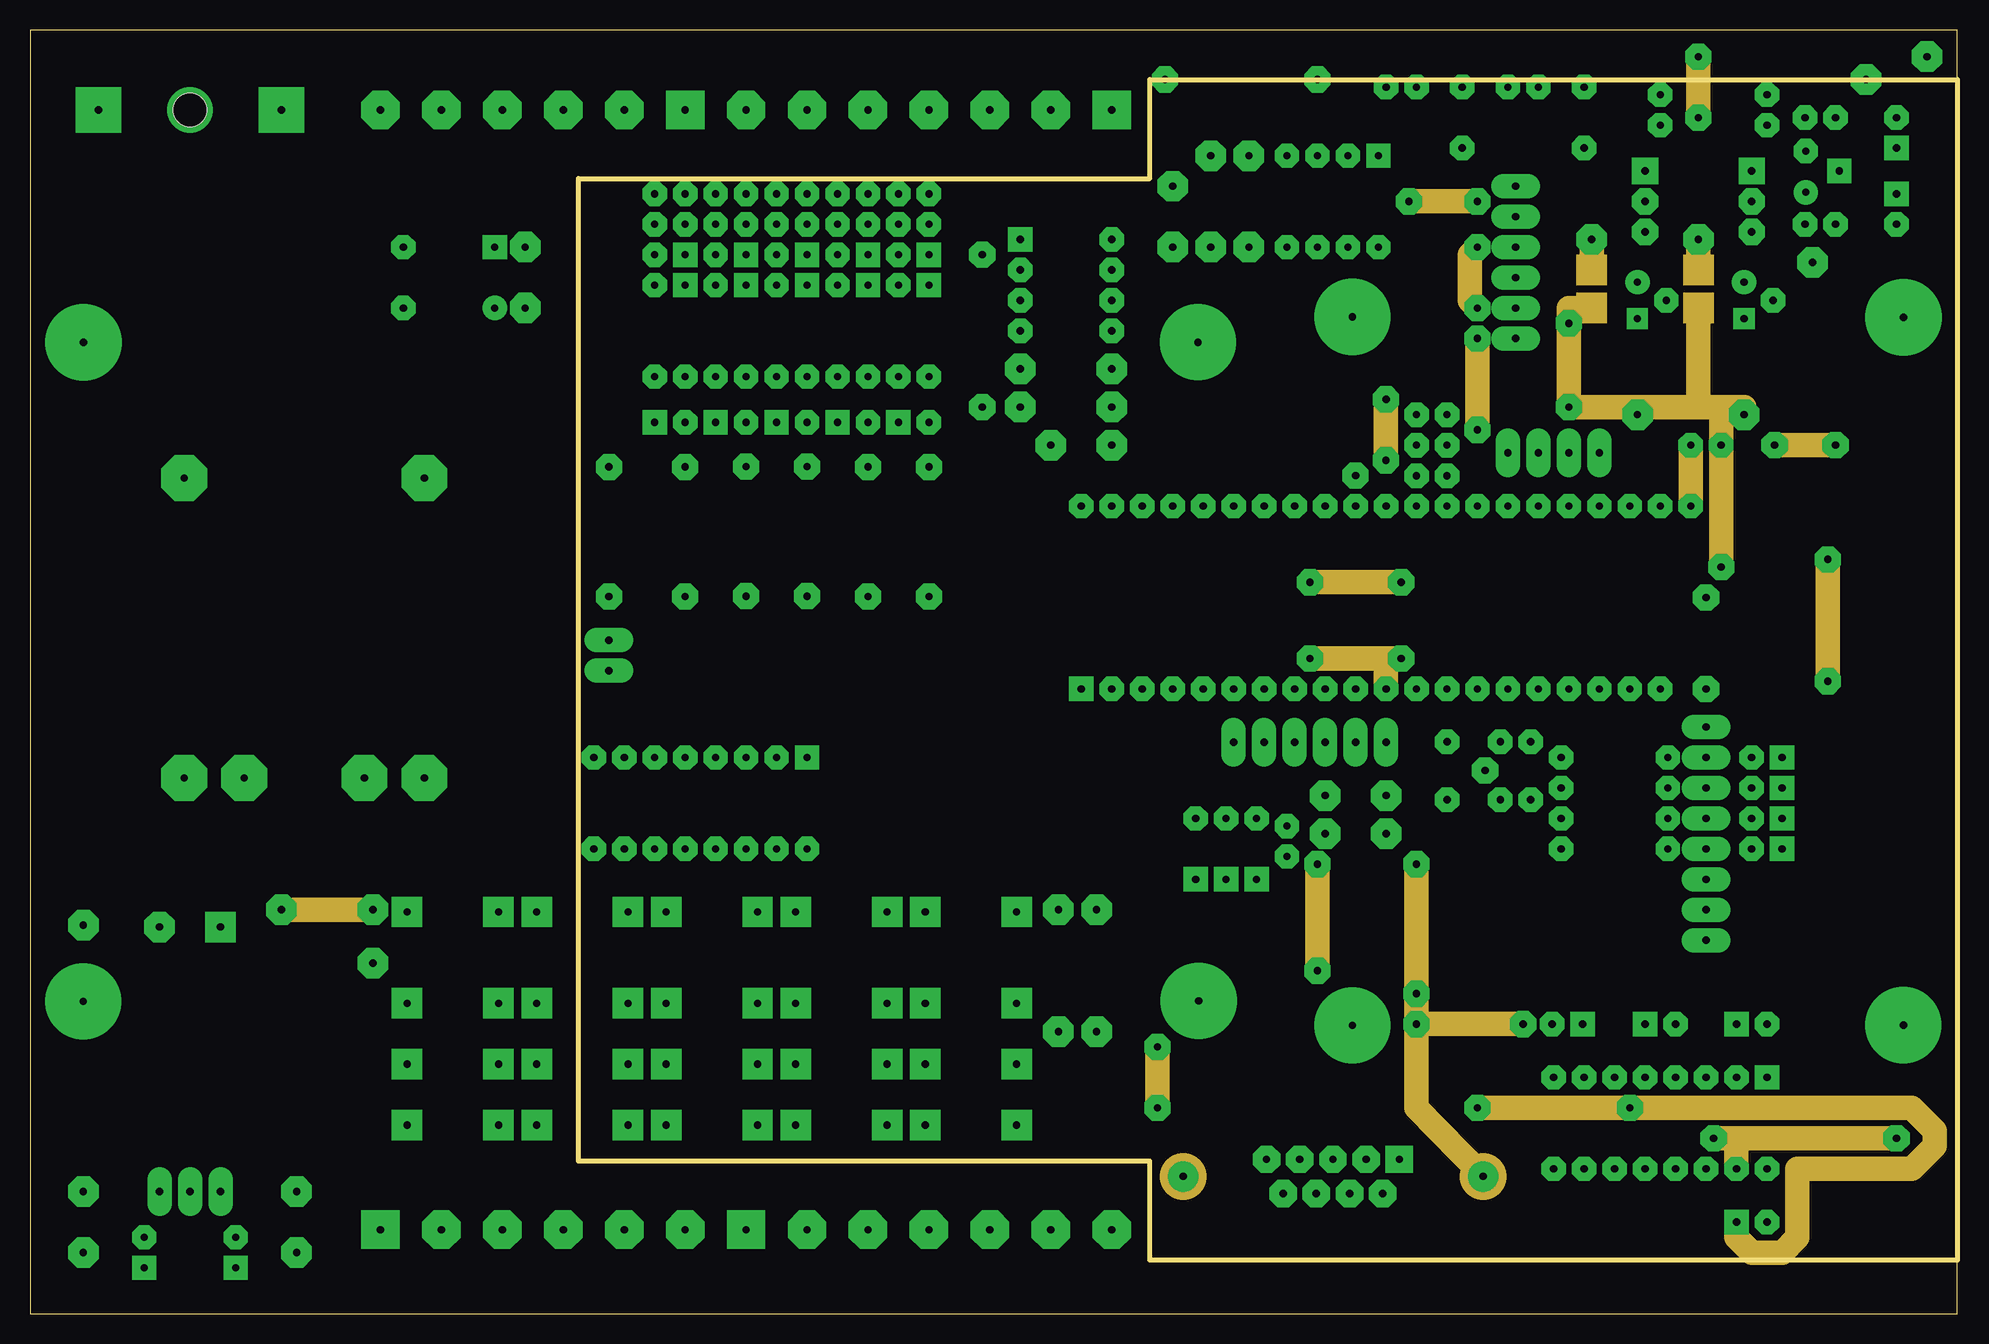
[diagram p8: board, inner layer Route15]
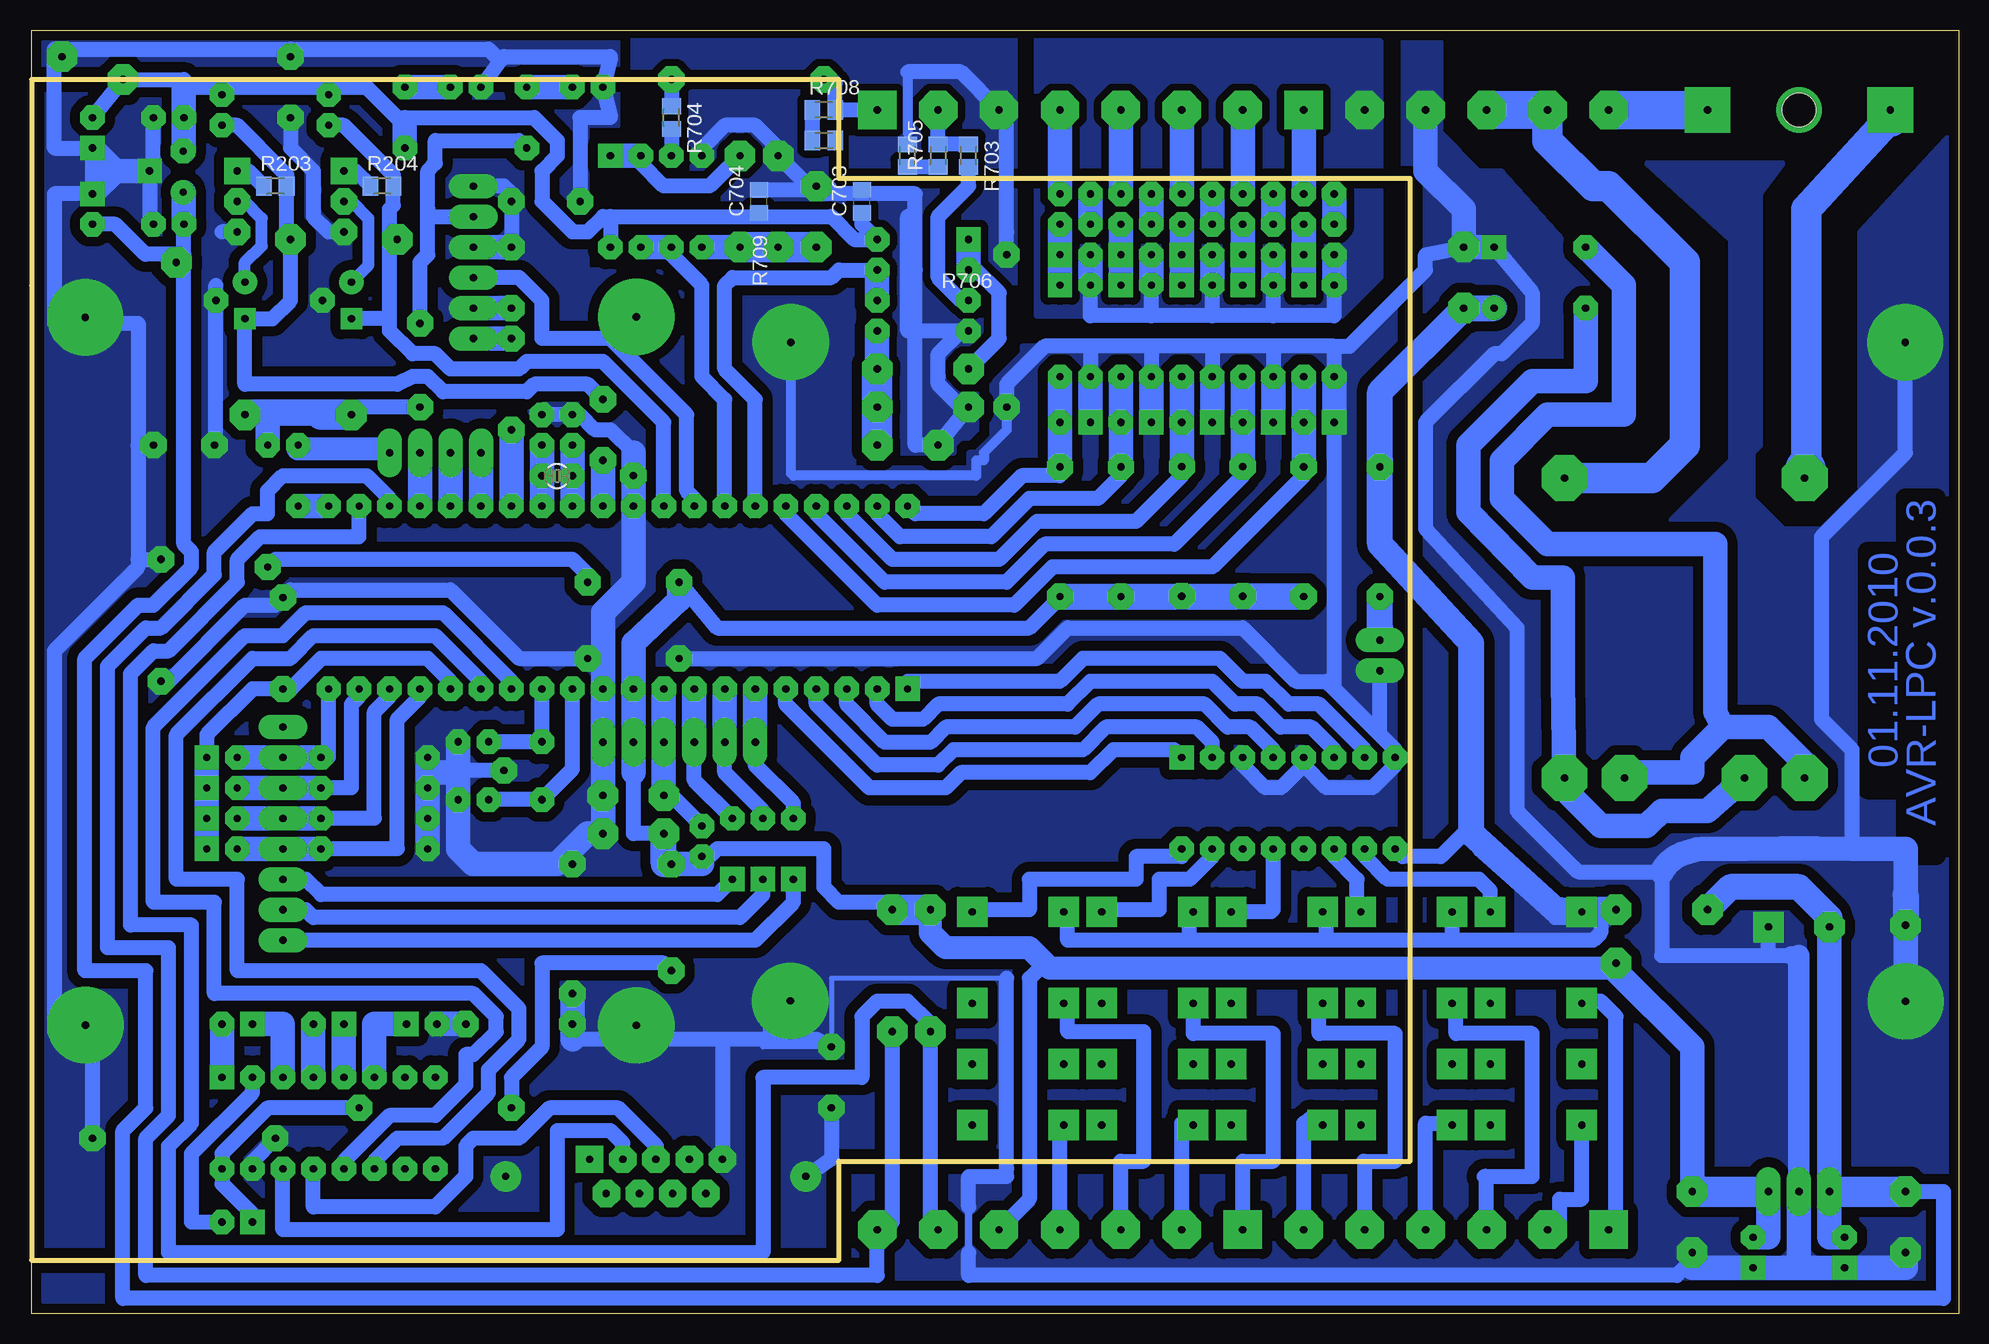
[diagram p9: board, bottom side, seen from below]

Size 160.66 x 107 mm. Coordinates in mm from the lower left corner, seen from the top.
Outline: 160.66,4.45 160.66,0 0,0 0.01,107 160.66,107 160.66,85.72
Outline: 160.66,85.72 160.66,102.87 93.34,102.87 93.34,94.61 45.72,94.61 45.72,12.7 93.34,12.7 93.34,4.45 160.66,4.45
Outline: 160.66,85.72 160.66,4.45
Copper layers (1*16): Top 0.035mm / dielectric 1.5mm / Bottom 0.035mm
Design rules "default *": minimum track width 50mil, minimum drill 31mil, track to track 25mil, track to pad 20mil, pad to pad 20mil, via to via 20mil, smd to smd 8mil, copper to edge 25mil, drill to drill 25mil, minimum pad ring 18mil, minimum via ring 8mil, stop-mask expansion 4mil, vias tented up to drill 0mil, thermal gap 10mil
bKeepout: 4 lines

### Footprints (pad centres in the part's own frame; a part is rotated, then mirrored left to right if it is on the bottom)
DIL40 = drill 0.61 pad 2.032 square: 1 -24.13,-7.62 | drill 0.61 pad 2.032 octagon: 2 -21.59,-7.62; 3 -19.05,-7.62; 4 -16.51,-7.62; 5 -13.97,-7.62; 6 -11.43,-7.62; 7 -8.89,-7.62; 8 -6.35,-7.62; 9 -3.81,-7.62; 10 -1.27,-7.62; 11 1.27,-7.62; 12 3.81,-7.62; 13 6.35,-7.62; 14 8.89,-7.62; 15 11.43,-7.62; 16 13.97,-7.62; 17 16.51,-7.62; 18 19.05,-7.62; 19 21.59,-7.62; 20 24.13,-7.62; 21 24.13,7.62; 22 21.59,7.62; 23 19.05,7.62; 24 16.51,7.62; 25 13.97,7.62; 26 11.43,7.62; 27 8.89,7.62; 28 6.35,7.62; 29 3.81,7.62; 30 1.27,7.62; 31 -1.27,7.62; 32 -3.81,7.62; 33 -6.35,7.62; 34 -8.89,7.62; 35 -11.43,7.62; 36 -13.97,7.62; 37 -16.51,7.62; 38 -19.05,7.62; 39 -21.59,7.62; 40 -24.13,7.62
CP100X80X24 = drill 0.61 pad 2.032 octagon: + -1.27,0 | drill 0.61 pad 2.032 square: - 1.27,0
C100X86X24 = drill 0.61 pad 2.032 octagon: P$1 -1.27,0; P$2 1.27,0
CP500/300X100X24 = drill 0.61 pad 2.54 octagon: + 2.54,0 | drill 0.61 pad 2.54 square: - -2.54,0
C200X100X24 = drill 0.61 pad 2.54 octagon: P$1 -2.54,0; P$2 2.54,0
C0805 = smd 1.3 x 1.5: 1 -0.95,0; 2 0.95,0
LED5MM = drill 0.61 pad 2.032 octagon: A -1.27,0; K 1.27,0
D-5 = drill 0.61 pad 2.032 octagon: A 2.54,0 | drill 0.61 pad 2.032 square: C -2.54,0
D-2.5 = drill 0.61 pad 2.032 octagon: A 1.27,0 | drill 0.61 pad 2.032 square: C -1.27,0
ZDIO-2.5 = drill 0.61 pad 2.032 octagon: A 1.27,0; C -1.27,0
DB104 = drill 0.61 pad 2.032 round: + 2.54,3.81 | drill 0.61 pad 2.032 square: - -2.54,3.81 | drill 0.61 pad 2.032 octagon: AC1 -2.54,-3.81; AC2 2.54,-3.81
GSH15 = drill 0.61 pad 3.81 square: 1 -7.62,0; 2 7.62,0 | drill 0.61 pad 3.81 round: P$1 0,0 | hole 2.794: 0,0
DIL04 = drill 0.61 pad 2.032 square: 1 -1.27,-3.81 | drill 0.61 pad 2.032 octagon: 2 1.27,-3.81; 3 1.27,3.81; 4 -1.27,3.81
78LXX = drill 0.61 pad 2.032 square: GND 0,1.905 | drill 0.61 pad 2.032 round: IN 1.778,-0.889 | drill 0.61 pad 2.032 octagon: OUT -1.651,-0.889
78XX_VERTICAL_COOLER = drill 0.61 pad 2.032 long: GND 0,-2.54; IN -2.54,-2.54; OUT 2.54,-2.54
DIL16 = drill 0.61 pad 2.032 square: 1 -8.89,-3.81 | drill 0.61 pad 2.032 octagon: 2 -6.35,-3.81; 3 -3.81,-3.81; 4 -1.27,-3.81; 5 1.27,-3.81; 6 3.81,-3.81; 7 6.35,-3.81; 8 8.89,-3.81; 9 8.89,3.81; 10 6.35,3.81; 11 3.81,3.81; 12 1.27,3.81; 13 -1.27,3.81; 14 -3.81,3.81; 15 -6.35,3.81; 16 -8.89,3.81
DIL8 = drill 0.61 pad 2.032 square: 1 -3.81,-3.81 | drill 0.61 pad 2.032 octagon: 2 -1.27,-3.81; 3 1.27,-3.81; 4 3.81,-3.81; 5 3.81,3.81; 6 1.27,3.81; 7 -1.27,3.81; 8 -3.81,3.81
351 = drill 0.61 pad 2.54 square: 1 -3.81,-3.81; 16 -3.81,3.81; O1 8.89,-3.81; O2 8.89,3.81; P1 3.81,-3.81; P2 3.81,3.81; S1 13.97,-3.81; S2 13.97,3.81
MICC12 = drill 0.61 pad 2.184 octagon: 1 -6.35,0; 2 6.35,0
HC49U-V = drill 0.61 pad 2.032 octagon: 1 -2.413,0; 2 2.413,0
TC26V = drill 0.61 pad 2.032 octagon: 1 -1.27,0; 2 1.27,0
R100X86X24 = drill 0.61 pad 2.032 octagon: P$1 -1.27,0; P$2 1.27,0
M0805 = smd 1.3 x 1.6: 1 -0.95,0; 2 0.95,0
R200X86X24 = drill 0.61 pad 2.032 octagon: P$1 -2.54,0; P$2 2.54,0
R425X86X24 = drill 0.61 pad 2.184 octagon: P$1 -5.397,0; P$2 5.397,0
R400X100X24 = drill 0.61 pad 2.54 octagon: P$1 -5.08,0; P$2 5.08,0
R300X86X24 = drill 0.61 pad 2.184 octagon: P$1 -3.81,0; P$2 3.81,0
R350X86X24 = drill 0.61 pad 2.032 octagon: P$1 -4.445,0; P$2 4.445,0
R300X100X24 = drill 0.61 pad 2.54 octagon: P$1 -3.81,0; P$2 3.81,0
RP0 = drill 0.61 pad 2.184 square: 1 -2.54,0 | drill 0.61 pad 2.184 octagon: 2 0,0; 3 2.54,0
02P = drill 0.61 pad 2.032 long: 1 -1.27,0; 2 1.27,0
06P = drill 0.61 pad 2.032 long: 1 -6.35,0; 2 -3.81,0; 3 -1.27,0; 4 1.27,0; 5 3.81,0; 6 6.35,0
08P = drill 0.61 pad 2.032 long: 1 -8.89,0; 2 -6.35,0; 3 -3.81,0; 4 -1.27,0; 5 1.27,0; 6 3.81,0; 7 6.35,0; 8 8.89,0
04P = drill 0.61 pad 2.032 long: 1 -3.81,0; 2 -1.27,0; 3 1.27,0; 4 3.81,0
P1-17 = drill 0.61 pad 2.54 octagon: TP 0,0
EI38-2 = drill 0.61 pad 3.81 octagon: 1 -12.497,10.008; 5 -12.497,-10.008; 6 12.497,-10.008; 7 12.497,-5.004; 9 12.497,5.004; 10 12.497,10.008
TO92-CLP = drill 0.61 pad 2.032 octagon: A 0,2.159 | drill 0.61 pad 1.778 square: C 1.524,-0.254 | drill 0.61 pad 2.032 round: R -1.524,-0.254
AWG/6-H = drill 0.61 pad 3.2 square: 1 12.7,0 | drill 0.61 pad 3.2 octagon: 2 7.62,0; 3 2.54,0; 4 -2.54,0; 5 -7.62,0; 6 -12.7,0
AWG/7-H = drill 0.61 pad 3.2 square: 1 15.24,0 | drill 0.61 pad 3.2 octagon: 2 10.16,0; 3 5.08,0; 4 0,0; 5 -5.08,0; 6 -10.16,0; 7 -15.24,0
H3R09RA = drill 0.61 pad 2.286 square: 1 5.537,1.422 | drill 0.61 pad 2.286 octagon: 2 2.769,1.422; 3 0,1.422; 4 -2.769,1.422; 5 -5.537,1.422; 6 4.153,-1.422; 7 1.384,-1.422; 8 -1.384,-1.422; 9 -4.153,-1.422

### Placement (x,y rotation side)
AVR-LPC  111.76,59.69 0 top
C201  155.57,92.08 90 top
C202  149.22,90.81 0 top
C203  149.22,99.69 0 top
C204  155.57,98.42 270 top
C205  13.34,32.22 180 top
C206  41.27,86.36 90 top
C207  9.53,5.08 270 top
C208  4.45,7.62 270 top
C209  22.23,7.62 270 top
C210  17.14,5.08 270 top
C301  110.49,43.18 0 top
C302  123.83,42.84 0 top
C303  123.83,47.66 0 top
C304  118.11,73.66 90 top
C305  115.57,73.66 90 top
C306  110.49,40.01 0 top
C307  143.51,24.13 180 top
C308  143.51,7.62 180 top
C309  135.89,24.13 180 top
C310  128.14,24.13 0 top
C501  53.34,74.3 180 top
C502  58.42,74.29 180 top
C503  63.5,74.29 180 top
C504  68.58,74.29 180 top
C505  73.66,74.29 180 top
C701  87.63,72.39 180 top
C702  95.25,91.44 90 top
C703  91.44,92.71 90 bottom
C704  100.01,92.71 90 bottom
D201  124.46,102.23 180 top
D202  114.3,102.23 180 top
D401  97.16,38.73 90 top
D402  99.69,38.73 90 top
D403  102.23,38.73 90 top
D404  144.78,38.73 180 top
D405  144.78,41.27 180 top
D406  144.78,43.81 180 top
D407  144.78,46.35 180 top
D501  53.34,90.81 0 top
D502  58.42,90.81 0 top
D503  53.34,88.27 180 top
D504  58.42,88.27 180 top
D505  63.5,90.81 0 top
D506  68.58,90.81 0 top
D507  63.5,88.27 180 top
D508  68.58,88.27 180 top
D509  73.66,90.81 0 top
D510  73.66,88.27 180 top
DB201  34.92,86.36 270 top
F201  13.34,100.33 180 top
I501  53.34,81.92 180 top
I502  58.42,81.92 180 top
I503  63.5,81.92 180 top
I504  68.58,81.92 180 top
I505  73.66,81.92 180 top
IC201  148.91,95.25 270 top
IC202  13.34,12.7 0 top
IC301  135.89,15.88 180 top
IC601  55.88,42.55 180 top
IC701  86.36,85.72 270 top
IC702  108.58,92.71 180 top
K601  35.24,29.67 270 top
K602  46.04,29.67 270 top
K603  56.84,29.67 270 top
K604  67.63,29.67 270 top
K605  78.42,29.67 270 top
L201  79.38,81.92 90 top
Q301  118.11,45.25 90 top
Q302  116.84,69.82 0 bottom
R201  144.78,100.33 90 top
R202  135.89,100.33 90 top
R203  140.34,93.98 0 bottom
R204  131.44,93.98 0 bottom
R205  129.54,99.69 270 top
R206  119.38,99.69 270 top
R207  48.26,65.18 90 top
R301  104.78,39.37 270 top
R302  85.72,28.57 90 top
R303  88.9,28.57 90 top
R401  139.7,55.88 270 top
R402  132.08,46.35 0 top
R403  132.08,43.81 0 top
R404  132.08,41.27 0 top
R405  132.08,38.73 0 top
R501  54.61,65.18 270 top
R502  59.69,65.2 270 top
R503  53.34,93.34 180 top
R504  58.42,93.34 180 top
R505  64.77,65.2 270 top
R506  69.85,65.18 270 top
R507  63.5,93.34 180 top
R508  68.58,93.34 180 top
R509  74.93,65.18 270 top
R510  73.66,93.34 180 top
R701  86.36,78.74 180 top
R702  101.6,92.71 90 top
R703  82.55,96.52 270 bottom
R704  107.31,99.69 270 bottom
R705  85.09,96.52 90 bottom
R706  87.63,96.52 270 bottom
R707  86.36,75.56 0 top
R708  94.61,100.33 0 bottom
R709  94.61,97.79 180 bottom
R710  98.42,92.71 270 top
RP201  143.51,92.71 270 top
RP202  134.62,92.71 270 top
SL201  48.26,54.86 270 top
SL301  106.68,47.62 0 top
SL401  139.7,40.01 270 top
SL402  123.83,87.63 270 top
SL403  127,71.75 180 top
TP1  148.59,87.63 0 top
TP2  153.03,102.87 0 top
TP3  28.57,29.21 0 top
TP4  139.06,89.53 0 top
TP5  130.18,89.53 0 top
TP6  158.12,104.78 0 top
TR201  22.86,57.15 270 top
VR201  143.13,84.45 270 top
VR202  134.24,84.45 270 top
X101  41.91,100.33 0 top
X102  74.93,100.33 0 top
X103  41.91,6.99 180 top
X104  74.93,6.99 180 top
X301  108.6,11.43 0 top

### Tracks (layer width: path | path; a pad name or v marks a point on that pad's centre or on a via)
+5V  (via drill 0.61 pad 2.03, 0.61 pad 2.18, 0.61 pad 2.54)
  Top 0.61: v106.68,60.96 v114.3,60.96 | v140.97,62.23 v140.97,72.39 | v120.65,17.14 v133.35,17.14 | v107.31,37.47 v107.31,28.57 | v128.27,75.56 v128.27,82.55
  Route15 2.032: v107.31,37.47 v107.31,28.57 | v140.97,62.23 v140.97,72.39 140.97,75.56 | v106.68,60.96 v114.3,60.96 | v120.65,17.14 v133.35,17.14 156.84,17.14 158.75,15.24 158.75,13.97 156.84,12.06 147.32,12.06 147.32,6.35 146.05,5.08 143.51,5.08 142.24,6.35 C308.- | 133.99,75.56 v133.99,74.93 | 133.99,75.56 v128.27,75.56 v128.27,82.55 128.27,83.82 130.18,83.82 | 140.97,75.56 142.88,75.56 v142.88,74.93 | 140.97,75.56 139.06,75.56 | 139.06,75.56 133.99,75.56 | 139.06,75.56 139.06,83.82
  Bottom 0.406: TP3.TP 28.78,29.21 28.78,28.78
  Bottom 1.27: R303.P$2 89.4,34.29 93.34,34.29 94.61,35.56 94.61,38.73 103.5,38.73 104.14,38.1 R301.P$2 | v114.3,60.96 114.3,61.59 115.57,62.87 140.34,62.87 v140.97,62.23 | C306.P$1 110.49,40.01 110.49,45.09 | v133.35,17.14 140.97,17.14 144.78,13.34 IC301.16 144.78,10.79 142.24,8.26 C308.- | v120.65,17.14 120.65,19.68 118.11,22.23 118.11,29.21 107.95,29.21 v107.31,28.57 | v133.99,74.93 133.99,75.56 v128.27,75.56 | 140.97,74.93 v142.88,74.93 | 74.84,59.78 77.47,57.15 103.5,57.15 v106.68,60.96 | v128.27,82.55 128.27,87.63 127.64,88.27 127.64,91.44 | 127.64,91.44 SL402.2 | 127.64,91.44 127.64,92.08 127.64,95.25 127,95.89 127,97.79 120.02,97.79 R206.P$2 | X104.5 77.47,9.53 77.47,27.94 76.2,29.21 | IC202.OUT 16.51,10.16
  Bottom 1.905: 136.84,75.09 136.53,74.93 | v142.88,74.93 142.56,75.09 | R302.P$2 85.72,31.75 84.45,30.48 77.47,30.48 76.2,29.21 75.77,28.78 28.78,28.78 28.57,28.57
  Bottom 2.032: IC202.OUT 15.88,6.35 C210.+ | v106.68,60.96 106.68,59.46 110.49,55.88 AVR-LPC.10 SL301.5 110.49,45.09 | C209.P$1 22.23,22.23 28.57,28.57 | R301.P$2 104.78,37.47 v107.31,37.47 | v140.97,72.39 140.97,74.93
  Bottom 2.184: R506.P$2 64.8,59.78 R505.P$2 | R506.P$2 R501.P$2 59.66,59.78 R502.P$2 | R509.P$2 74.84,59.78 R506.P$2 | v107.31,37.47 107.95,37.47 C306.P$1
  Bottom 2.222: 142.56,75.09 136.84,75.09
  Bottom 2.54: R302.P$2 R303.P$2 | v133.99,74.93 136.53,74.93 | 16.51,10.16 C209.P$1
+12V
  Bottom 0.025: 129.54,99.69 129.54,99.06
  Bottom 1.27: 147.96,102.87 TP2.TP C204.+ | 147.96,102.87 147.96,102.23 | 112.39,91.44 113.03,91.44 114.3,90.17 115.57,90.17 118.11,92.71 118.11,95.25 116.84,96.52 116.84,97.79 118.75,99.69 129.54,99.69 130.18,99.69 132.72,102.23 135.89,102.23 | 112.39,91.44 IC702.8 | 112.39,91.44 99.69,91.44 | 99.69,91.44 93.98,91.44 92.08,89.53 IC701.8 91.44,90.81 C703.1 | 147.96,102.87 147.32,102.23 144.78,102.23 | 135.89,102.23 R202.P$2 | 144.78,102.23 135.89,102.23 | 144.78,102.23 R201.P$2 | C704.1 99.69,91.44
  Bottom 2.032: IC201.OUT 147.96,96.9 C203.P$1 147.96,102.23 | 129.54,99.06 R205.P$2
+15V  (via drill 0.61 pad 2.54)
  Top 0.61: v20.95,33.66 v28.57,33.66
  Route15 2.032: v20.95,33.66 v28.57,33.66
  Bottom 1.27: 42.55,31.11 30.48,31.11 29.84,31.75 29.84,33.02 33.02,33.02 33.66,33.02 31.75,33.16 K601.1 32.38,33.66 33.66,33.66 34.29,33.66 40.01,38.73 | 42.55,31.11 42.23,31.43 K602.1 | K603.1 52.7,33.16 52.7,31.11 | 42.55,31.11 52.7,31.11 | K604.1 64.14,33.16 64.14,31.11 | 52.7,31.11 64.14,31.11 | 74.3,33.02 74.3,33.16 K605.1 74.3,33.02 | 64.14,31.11 74.3,31.11 74.3,33.02 | C208.P$1 1.27,10.16 1.27,1.27 153.03,1.27 153.03,15.24 151.13,17.14 151.13,28.57 156.21,28.57 156.21,54.61 151.76,59.05 150.5,59.05 147.32,62.23 147.32,63.5 147.96,64.14 147.96,87.63 147.95,88.27 147.95,88.3 | 147.95,88.3 148.59,88.3 | 148.59,88.3 151.16,88.3 153.67,90.81 C201.+ | 147.95,88.3 147.95,90.17 C202.P$1 | 10.16,10.16 IC202.IN | R207.P$2 48.26,71.12 | IC601.9 46.35,38.1 43.18,38.1 40.64,40.64 | 148.59,88.3 TP1.TP
  Bottom 2.032: C207.+ 10.79,6.35 IC202.IN C205.+ | IC201.IN 147.96,93.47 C202.P$1
  Bottom 2.184: 48.26,71.12 48.26,76.83 C206.P$1 DB201.+ | v20.95,33.66 19.05,35.56 13.34,35.56 10.79,33.02 C205.+ | v28.57,33.66 29.21,33.66 29.84,33.66 K601.1 33.66,33.66 40.64,40.01 40.64,40.64 40.64,55.88 48.26,64.14 R207.P$2
  Bottom 2.54: C208.P$1 10.16,10.16
  pour Bottom (no thermals): 36.83,31.11 36.83,37.47 33.66,34.29 29.21,34.29 29.21,32.38 30.48,31.11
AGND
  Bottom 0.838: 87.63,103.5 87.63,98.42 | C702.P$2 93.98,93.98
  Bottom 1.27: C702.P$2 95.89,93.98 R710.P$1 98.42,97.16 100.33,99.06 102.87,99.06 104.78,97.16 IC702.4 | 87.63,91.44 87.63,81.92 83.82,81.92 IC701.4 83.19,81.92 85.09,80.01 85.09,78.11 85.09,77.47 83.19,75.56 R707.P$1 C701.P$2 87,72.39 87,87 87,93.34 94.61,93.34 C702.P$2 | L201.2 79.38,90.14 | 79.38,90.14 79.38,90.17 | 87.63,103.5 83.19,103.5 X102.3 79.38,99.69 79.38,90.14 | C704.2 95.57,93.66 C702.P$2
  pour Bottom (no thermals): 78.74,82.55 78.74,106.68 110.49,106.68 110.49,97.79 113.03,97.79 113.03,88.27 90.81,88.27 90.81,71.75 83.82,71.75 83.82,72.39 83.19,73.03 82.55,73.03 81.92,73.66 81.92,77.47 79.38,80.01 79.38,81.92
AI0
  Bottom 1.27: X102.2 R705.2 R703.1
AI1  (via drill 0.6 pad 2.18)
  Top 0.61: v94.61,102.87 v107.31,102.87
  Bottom 1.27: X102.1 90.81,100.33 R708.2 93.67,102.56 93.98,102.87 v94.61,102.87 | v107.31,102.87 R704.1
AIN_PUT0
  Bottom 1.27: AVR-LPC.35 100.33,76.2 102.87,78.74 102.87,85.72 102.23,86.36 93.98,86.36 93.34,87 IC701.7
  Bottom 2.032: IC701.7 IC701.6
AIN_PUT1
  Bottom 1.27: AVR-LPC.34 102.87,76.2 104.78,78.11 104.78,85.72 107.31,88.27 IC702.6
  Bottom 2.032: IC702.6 IC702.7
AREF
  Route15 2.032: TP5.TP 130.18,87
  Bottom 1.27: 130.81,82.93 130.81,82.55 130.81,81.92 128.91,80.01 127,80.01 125.73,78.74 120.02,78.74 119.38,79.38 113.03,79.38 107.95,74.3 AVR-LPC.32 | 130.81,82.93 130.81,83.82 | 130.81,83.82 130.81,89.53 | 130.81,89.53 130.81,92.08 130.5,92.39 R204.2 130.5,94.94 130.81,95.25 134.62,99.06 R202.P$1 | 130.81,82.93 130.81,83.82 | 130.81,82.93 VR202.C | 130.81,89.53 TP5.TP
AVCC  (via drill 0.6 pad 2.18, 0.61 pad 2.18)
  Top 0.61: v113.03,71.12 v113.03,76.2
  Route15 2.032: TP4.TP 139.06,87 | v113.03,71.12 v113.03,76.2
  Bottom 1.27: v113.03,76.2 114.3,77.47 118.75,77.47 119.38,76.83 126.36,76.83 127.64,78.11 128.91,78.11 130.18,77.47 142.88,77.47 VR201.C 140.59,82.93 139.06,84.45 TP4.TP 139.38,89.86 R203.2 139.38,94.94 139.7,95.25 143.51,99.06 R201.P$1
  Bottom 2.032: AVR-LPC.30 v113.03,71.12
COL0_ISP_MOSI
  Bottom 1.27: D401.A 97.16,42.55 100.33,45.72 SL301.1
  Bottom 2.032: SL301.1 AVR-LPC.6
COL1_ISP_MISO
  Bottom 1.27: D402.A 99.69,41.91 102.87,45.09 SL301.2
  Bottom 2.032: SL301.2 AVR-LPC.7
COL2_ISP_SCK
  Bottom 1.27: D403.A 105.41,44.45 SL301.3
  Bottom 2.032: SL301.3 AVR-LPC.8
DATA0  (via drill 0.61 pad 2.03)
  Top 0.61: v138.43,72.39 v138.43,67.31
  Route15 2.032: v138.43,72.39 v138.43,67.31
  Bottom 1.27: SL403.1 130.81,72.07
  Bottom 1.905: v138.43,72.39 138.43,72.07 130.81,72.07
  Bottom 2.032: v138.43,67.31 AVR-LPC.21
DATA1
  Bottom 2.032: AVR-LPC.24 SL403.2
DATA2
  Bottom 2.032: AVR-LPC.25 SL403.3
DATA3
  Bottom 2.032: AVR-LPC.26 SL403.4
EN  (via drill 0.61 pad 2.18)
  Top 0.61: v120.65,73.66 v120.65,81.28
  Route15 2.032: v120.65,73.66 v120.65,81.28
  Bottom 2.032: AVR-LPC.27 v120.65,73.66 | v120.65,81.28 SL402.6
GND  (via drill 0.6 pad 2.18, 0.61 pad 2.18, 0.61 pad 2.54, 0.61 pad 6.35)
  Top 0.559: v139.06,104.78 v139.06,99.69
  Top 0.61: v106.68,54.61 v114.3,54.61 | v115.57,26.67 v115.57,37.47 | v115.57,24.13 v124.46,24.13 | v149.86,62.87 v149.86,52.7 | v93.98,22.23 v93.98,17.14 | v155.57,14.61 v140.34,14.61 | v150.5,72.39 v145.41,72.39 | v120.65,88.9 v120.65,83.82 | v114.94,92.71 v120.65,92.71
  Route15 2.032: v121.13,11.43 115.57,17.14 v115.57,24.13 | v93.98,22.23 v93.98,17.14 | v115.57,24.13 v124.46,24.13 | v115.57,37.47 v115.57,26.67 v115.57,24.13 | v155.57,14.61 142.24,14.61 | v149.86,62.87 v149.86,52.7 | v150.5,72.39 v145.41,72.39 | v120.65,88.9 120.02,88.27 120.02,84.45 v120.65,83.82 | v114.94,92.71 v120.65,92.71 | v139.06,104.78 v139.06,99.69 | 113.03,54.61 v106.68,54.61 | 113.03,54.61 v114.3,54.61 | AVR-LPC.11 113.03,54.61 | 142.24,14.61 IC301.15 | v140.34,14.61 142.24,14.61
  Bottom 0.406: 82.55,6.99 82.55,11.43 80.01,11.43 79.38,12.06 | 79.38,27.94 93.98,27.94 v93.98,22.23 99.69,22.23 99.69,22.86
  Bottom 0.635: 82.55,5.08 82.55,6.99 82.55,8.89
  Bottom 0.838: v97.36,80.97 97.36,70.06 97.16,69.85 81.92,69.85 81.92,71.12 81.28,71.12 81.28,71.75 79.38,73.66 79.38,76.2
  Bottom 1.27: I501.3 52.07,80.64 | 52.07,80.64 57.15,80.64 | 57.15,80.64 I502.3 | 57.15,80.64 62.23,80.64 | 62.23,80.64 I503.3 | 62.23,80.64 67.31,80.64 | 67.31,80.64 72.39,80.64 | 72.39,80.64 I505.3 | 67.31,80.64 I504.3 | 113.03,54.61 120.02,54.61 125.73,60.33 139.06,60.33 R401.P$1 140.34,59.05 142.88,59.05 149.22,52.7 v149.86,52.7 | C304.P$2 C305.P$2 114.94,74.93 113.67,73.66 112.39,73.66 110.49,71.75 | 151.76,72.39 151.76,62.87 | v155.57,14.61 155.57,23.5 158.75,23.5 158.75,55.24 151.76,62.23 151.76,62.87 | v156.16,24.04 155.42,23.5 | 151.76,62.87 v149.86,62.87 | DB201.- 35.56,85.09 35.56,82.55 38.1,80.01 38.73,80.01 44.45,74.3 44.45,65.41 36.83,57.15 36.83,41.91 31.75,36.83 24.77,36.83 24.77,29.84 15.88,29.84 | v4.46,80.96 4.46,71.74 11.43,64.77 11.43,49.53 8.89,46.99 8.89,38.73 | v145.41,72.39 145.29,72.52 VR201.A 145.29,85.72 | 151.76,72.39 v150.5,72.39 | 151.76,72.39 151.76,82.55 156.17,82.55 | 156.17,82.55 v156.17,83.05 | 156.17,82.55 158.75,82.55 158.75,93.34 C201.- C204.- 158.75,97.16 158.75,105.41 139.06,105.41 | RP202.3 135.89,90.17 137.16,91.44 137.16,95.25 139.06,97.16 v139.06,99.69 | RP201.3 144.78,90.17 | C202.P$2 150.81,90.81 IC201.GND 150.5,95.25 C203.P$2 | 121.6,104.46 121.28,104.78 112.39,104.78 D202.K 112.39,99.69 114.94,99.69 v114.94,92.71 | 121.6,104.46 D201.K | 115.57,22.86 109.22,22.86 109.22,23.76 v110.23,24.02 108.96,23.24 108.58,22.86 102.87,22.86 | 99.06,22.86 99.69,22.86 102.87,22.86 | 99.06,22.86 99.06,25.68 v97.41,26.06 | 99.06,22.86 95.25,22.86 v93.98,22.23 | v93.98,17.14 93.98,12.9 v96.11,11.43 | 22.23,4.45 23.5,3.17 82.55,3.17 82.55,5.08 | IC301.15 142.24,12.7 v140.34,14.61
  Bottom 1.27: 52.07,52.07 52.7,52.7 55.24,52.7 59.69,57.15 74.3,57.15 76.83,54.61 v106.68,54.61 | 52.07,80.64 50.8,80.64 44.45,87 44.45,88.27 C206.P$2 | v120.65,88.9 v120.65,92.71 120.65,93.34 121.28,93.98 SL402.1 | L201.1 79.38,76.2 79.38,77.47 76.2,80.64 72.39,80.64 | 139.06,105.41 v139.06,104.78 | 139.06,105.41 122.56,105.41 121.6,104.46 | 52.07,52.07 C501.- | 15.88,29.84 13.97,29.84 | 15.88,29.84 C205.- | X301.5 103.07,22.66 102.87,22.86 | 82.55,8.89 82.55,11.43 79.38,11.43 79.38,12.06 79.38,27.94 | v121.28,45.28 124.78,45.28 | 48.26,48.26 46.99,46.99 IC601.8 46.99,45.72 48.9,43.81 52.7,43.81 54.61,45.72 | 48.26,48.26 SL201.2 | 52.07,52.07 48.26,48.26 | 54.61,45.72 56.52,43.81 57.78,43.81 59.69,45.72 IC601.3 | 54.61,45.72 IC601.5
  Bottom 1.524: 13.97,29.84 13.34,29.84
  Bottom 1.778: 13.34,29.84 IC202.GND
  Bottom 2.032: C501.- I501.3 | C502.- | I502.3 C502.- | C503.- 62.23,75.56 I503.3 | I505.3 | I505.3 C505.- | 13.34,3.81 C207.- 4.45,3.81 C208.P$2 | 13.34,3.81 C210.- 22.23,3.81 22.23,4.45 C209.P$2 | IC202.GND 13.34,3.81 | I504.3 C504.- | 153.67,95.25 IC201.GND | 153.67,95.25 C201.- | C204.- 153.67,95.25 | 125.09,45.09 C302.P$2 125.09,38.73 123.83,37.47 116.84,37.47 114.3,40.01 C306.P$2 C301.P$2 SL301.6 AVR-LPC.11 113.03,54.61 113.03,58.42 110.49,60.96 AVR-LPC.31 v110.49,69.85 110.49,71.75 | 125.09,45.09 C303.P$2 | R405.P$1 R404.P$1 127.64,45.09 | 127.64,45.09 R402.P$1 | 125.09,45.09 127.64,45.09 | v115.57,26.67 v115.57,24.13 115.57,22.86 | 24.77,36.83 arc33 23.5,38.1 arc29 20.95,38.73 arc-1 17.78,38.73 arc1 8.89,38.73 4.45,38.73 4.45,34.92 v4.44,26.02 | DB201.- C206.P$2 41.27,92.08 44.45,95.25 X101.3 | v124.46,24.13 C310.+ | v120.65,83.82 SL402.5 | v120.65,88.9 SL402.3
  Bottom 2.184: 4.45,34.92 v4.45,32.38
  pour Bottom (isolate 0.838, no thermals): 0.64,0 0.64,98.42 8.26,90.17 8.26,68.58 11.43,65.41 14.61,65.41 17.14,67.94 17.14,71.75 16.51,72.39 16.51,93.34 14.61,95.89 26.04,95.89 19.05,89.53 19.05,71.12 24.77,65.41 36.2,65.41 38.1,67.94 38.1,71.12 35.56,73.66 29.84,73.66 27.94,74.93 27.94,87 30.48,89.53 33.02,89.53 38.1,95.25 40.01,95.25 43.18,98.42 43.18,106.68 46.35,106.68 46.35,85.72 50.8,80.64 78.11,80.64 78.11,80.01 80.64,77.47 80.64,73.03 81.92,71.75 82.55,71.75 82.55,70.48 92.08,70.48 92.08,87 114.3,87 114.3,99.06 111.76,99.06 111.76,106.68 160.02,106.68 160.02,0
GNDI
  Bottom 1.27: 57.15,83.19 52.07,83.19 I501.2 | 57.15,83.19 I502.2 | 57.15,83.19 62.23,83.19 | 62.23,83.19 I503.2 | 62.23,83.19 67.31,83.19 | 67.31,83.19 72.39,83.19 I505.2 | 67.31,83.19 I504.2
  Bottom 2.032: I505.2 D510.A | I502.2 D504.A | I504.2 D508.A | I503.2 D507.A | I501.2 D503.A
  pour Bottom (isolate 0.635, no thermals): 48.26,86.36 48.26,106.05 76.83,106.68 76.83,83.19 72.39,83.19 51.44,83.19
I0
  Bottom 2.032: R503.P$1 X101.1
I1
  Bottom 2.032: R504.P$1 X102.7
I2
  Bottom 2.032: R507.P$1 X102.6
I3
  Bottom 2.032: R508.P$1 X102.5
I4
  Bottom 2.032: R510.P$1 X102.4
IN_PUT0
  Bottom 1.27: 54.84,71.53 54.84,70.89 54.61,71.12 R501.P$1 54.61,70.26 54.61,69.85 62.23,62.23 75.56,62.23 78.74,59.05 90.17,59.05 97.79,66.67 AVR-LPC.36
  Bottom 2.032: C501.+ I501.4 | C501.+ | R501.P$1 C501.+
IN_PUT1
  Bottom 1.27: 59.69,71.12 R502.P$1 59.69,70.28 59.69,69.85 65.41,64.14 76.2,64.14 79.38,60.96 89.53,60.96 95.25,66.67 AVR-LPC.37
  Bottom 2.032: R502.P$1 C502.+ | C502.+ | C502.+ I502.4
IN_PUT2
  Bottom 1.27: 64.77,71.12 R505.P$1 64.77,70.28 64.77,69.85 68.58,66.04 76.83,66.04 80.01,62.87 88.9,62.87 92.71,66.67 AVR-LPC.38
  Bottom 2.032: I503.4 | I503.4 C503.+ R505.P$1
IN_PUT3
  Bottom 1.27: R506.P$1 69.85,70.26 69.85,69.85 71.75,67.94 77.47,67.94 80.64,64.77 88.27,64.77 90.17,66.67 AVR-LPC.39
  Bottom 2.032: I504.4 69.85,76.83 C504.+ R506.P$1
IN_PUT4
  Bottom 1.27: R509.P$1 75.02,70.48 | R509.P$1 74.93,69.85 78.11,69.85 81.28,66.67 87,66.67 AVR-LPC.40 | R509.P$1
  Bottom 2.032: C505.+ I505.4 | C505.+ | R509.P$1 C505.+
ISP_RESET
  Bottom 1.27: C301.P$1 107.31,43.18 R301.P$1
  Bottom 2.032: AVR-LPC.9 SL301.4 C301.P$1
KB_INT
  Bottom 1.27: AVR-LPC.16 125.73,52.7 127.64,54.61 136.53,54.61 139.06,52.07 R401.P$2 142.24,52.07 146.05,48.26 D407.C
  Bottom 2.032: D404.C D405.C D406.C D407.C
L
  Bottom 3.2: F201.1 X101.6
LPC_RXD
  Bottom 1.27: AVR-LPC.15 123.19,52.7 127,56.52 137.16,56.52 139.06,54.61 142.24,54.61 148.59,48.26 148.59,36.2 143.51,36.2 143.51,28.57 123.19,28.57 120.02,25.4 120.02,22.86 122.56,20.32 122.56,18.41 126.36,14.61 130.18,14.61 132.08,12.7 IC301.11
LPC_TXD
  Bottom 1.27: AVR-LPC.14 120.65,52.7 126.36,58.42 137.79,58.42 139.7,56.52 142.88,56.52 150.5,48.9 150.5,34.29 145.41,34.29 145.41,26.67 123.83,26.67 121.92,24.77 121.92,23.5 123.83,21.59 124.46,21.59 124.46,19.05 127,16.51 130.81,16.51 134.62,12.7 IC301.12
N
  Bottom 2.54: TR201.1 25.6,69.65 22.86,72.39 22.86,87.63 29.21,93.98 30.48,93.98 34.29,97.79 X101.5
  Bottom 3.175: X101.5 X101.4
N$1
  Bottom 2.54: 5.71,99.69 12.7,92.08 12.7,70.48 | TR201.5 12.85,70.48
  Bottom 3.2: 5.71,99.69 F201.2 | 12.85,70.48 12.7,70.48
N$3
  Bottom 1.016: VR201.R 142.88,87.63 141.45,89 141.45,91.29 142.88,92.71 RP201.2
N$4
  Bottom 2.032: IC301.3 139.7,24.13 C307.-
N$5
  Bottom 1.016: RP202.2 133.99,92.71 132.56,91.29 132.56,87.4 VR202.R
N$6
  Bottom 2.032: TR201.9 26.67,45.09 22.23,45.09 22.23,46.35 19.68,48.9 | 19.68,48.9 15.88,48.9 12.7,45.72 TR201.6 | DB201.AC1 27.94,85.72 27.94,74.93 34.29,74.93 38.1,71.12 38.1,67.94 34.29,64.14 20.32,64.14 20.32,50.16 19.68,48.9
N$7
  Bottom 1.27: R705.1 R706.2
N$9
  Bottom 2.032: IC301.1 C307.+
N$10
  Bottom 1.27: AVR-LPC.12 115.57,45.38 Q301.1 C302.P$1
N$11
  Bottom 1.27: AVR-LPC.13 Q301.2 C303.P$1
  Bottom 2.032: AVR-LPC.13
N$12
  Bottom 2.032: IC301.5 C309.-
N$13
  Bottom 2.032: IC301.4 C309.+
N$14
  Bottom 1.27: IC301.2 142.24,18.41 147.32,13.34 147.32,7.62 C308.+
N$15
  Bottom 1.27: RP201.1 142.56,95.25 R203.1
N$16
  Bottom 1.27: R702.P$2 104.14,93.98 107.95,93.98 109.86,95.89 IC702.2
  Bottom 2.032: IC702.2 IC702.1
N$19
  Bottom 2.032: IC301.6 132.08,24.13 C310.-
N$20
  Bottom 2.032: D201.A R205.P$1
N$21
  Bottom 1.27: R703.2 82.55,93.98 85.09,91.44 85.09,86.36 83.19,84.45 IC701.3
N$22
  Bottom 2.032: D501.C R503.P$2
N$23
  Bottom 2.032: I501.1 D503.C D501.A
N$24
  Bottom 1.27: D401.C 97.16,34.29 100.33,31.11 SL401.8
N$25
  Bottom 1.27: D402.C 99.69,34.92 101.6,33.02 137.16,33.02 137.79,33.66 SL401.7
N$26
  Bottom 2.032: D505.C R507.P$2
N$27
  Bottom 2.032: I503.1 D507.C D505.A
N$28
  Bottom 1.27: D403.C 103.5,34.92 136.53,34.92 137.79,36.2 SL401.6
N$29
  Bottom 1.27: SL201.1 48.26,57.15
  Bottom 2.184: 48.26,57.15 R207.P$1
N$34
  Bottom 2.032: D202.A R206.P$1
N$37
  Bottom 2.032: TR201.7 20.95,41.91 24.77,41.91 26.04,40.64 29.84,40.64 33.02,43.81 32.38,43.81 TR201.10 33.02,52.7 33.02,61.34 35.56,61.34 40.89,66.8 40.89,72.39 35.56,77.72 31.11,77.72 DB201.AC2
N$38
  Bottom 1.27: R709.2 R708.1
N$39
  Bottom 2.032: D509.C R510.P$2
N$40
  Bottom 2.032: I505.1 D510.C D509.A
N$41
  Bottom 2.032: R701.P$1 IC701.5
  Bottom 2.54: C701.P$1 R707.P$2 R701.P$1
N$42
  Bottom 1.27: R701.P$2 80.01,81.28 80.01,85.09 81.92,87 IC701.2
  Bottom 2.032: IC701.2 IC701.1
N$43
  Bottom 2.032: D502.C R504.P$2
N$44
  Bottom 2.032: I502.1 D504.C D502.A
N$45
  Bottom 2.032: R702.P$1 IC702.5
  Bottom 2.54: R702.P$1 R710.P$2 C702.P$1
N$47
  Bottom 1.27: RP202.1 133.66,95.25 R204.1
N$48
  Bottom 1.27: R704.2 IC702.3
N$51
  Bottom 2.032: D506.C R508.P$2
N$52
  Bottom 2.032: I504.1 D508.C D506.A
OUT_PUT0
  Bottom 1.27: AVR-LPC.1 87.63,52.7 74.93,52.7 73.03,54.61 61.59,54.61 59.69,52.7 57.78,52.7 55.88,50.8 53.34,50.8 49.53,46.99 IC601.7
OUT_PUT1
  Bottom 1.27: AVR-LPC.2 90.17,50.8 88.9,49.53 86.36,49.53 85.09,50.8 74.3,50.8 72.39,52.7 62.23,52.7 60.33,50.8 58.42,50.8 56.52,48.9 53.98,48.9 52.07,46.99 IC601.6
OUT_PUT2
  Bottom 1.27: AVR-LPC.3 92.71,50.8 89.53,47.62 85.72,47.62 84.45,48.9 73.66,48.9 71.75,50.8 62.87,50.8 60.96,48.9 59.05,48.9 57.15,46.99 IC601.4
OUT_PUT3
  Bottom 1.27: AVR-LPC.4 95.25,50.8 90.17,45.72 85.09,45.72 83.82,46.99 73.03,46.99 71.12,48.9 63.5,48.9 62.23,47.62 IC601.2
OUT_PUT4
  Bottom 1.27: AVR-LPC.5 97.79,50.8 90.81,43.81 84.45,43.81 83.19,45.09 72.39,45.09 70.48,46.99 65.41,46.99 IC601.1
Q0
  Bottom 1.27: K601.P1 31.11,26.04 29.84,26.04 28.57,24.77 28.57,7.62 X103.1
Q1
  Bottom 1.27: K601.S1 31.43,9.53 33.27,9.53 33.27,7.71 33.56,7.71 X103.2
Q2
  Bottom 1.27: K602.P1 41.91,25.86 41.91,23.34 35.56,23.34 35.56,11.43 39.37,11.43 | 39.37,11.43 39.57,11.43 | X103.3 39.37,11.43
Q3
  Bottom 1.27: K602.S1 42.55,15.7 42.55,15.88 44.45,15.88 X103.4
Q4
  Bottom 1.27: K603.P1 53.34,25.86 53.34,23.34 46.99,23.34 46.99,12.7 49.61,12.7 49.53,12.62 X103.5
Q5
  Bottom 1.27: K603.S1 53.98,16.34 54.61,15.88 54.61,10.79 | X103.6 54.61,10.79 | 54.61,10.79
Q6
  Bottom 1.27: K604.P1 63.82,23.34 57.15,23.34 57.15,12.7 59.69,12.7 X104.1
Q7
  Bottom 1.27: K604.S1 64.31,15.7 64.77,15.88 X104.2
Q8
  Bottom 1.27: K605.P1 74.3,25.54 74.3,23.5 67.94,23.5 67.94,12.7 69.85,12.7 X104.3
Q9
  Bottom 1.27: X104.4 74.93,15.38 K605.S1
RECIVE_FROM_PC
  Bottom 1.27: IC301.13 137.16,8.89 127,8.89 124.46,11.43 124.46,13.97 123.83,14.61 120.02,14.61 117.47,17.14 111.76,17.14 108.58,13.97 108.6,13.34 X301.3
RELAY0
  Bottom 1.27: K601.16 39.05,35.24 40.01,36.2 47.62,36.2 49.53,38.1 IC601.10
RELAY1
  Bottom 1.27: K602.16 50.16,33.8 50.16,36.2 52.07,38.1 IC601.11
RELAY2
  Bottom 1.27: K603.16 57.33,33.48 57.15,33.66 IC601.13
RELAY3
  Bottom 1.27: K604.16 70.48,33.66 66.67,33.66 66.67,36.2 64.14,36.2 62.23,38.1 IC601.15
RELAY4
  Bottom 1.27: K605.16 81.92,33.66 77.47,33.66 77.47,36.2 68.58,36.2 68.58,38.1 64.77,38.1 IC601.16
ROW0
  Bottom 1.27: R405.P$2 130.18,38.73 130.18,49.53 128.27,51.44 AVR-LPC.17
  Bottom 2.032: D404.A SL401.5 R405.P$2
ROW1
  Bottom 1.27: R404.P$2 132.08,41.27 132.08,50.16 130.81,51.44 AVR-LPC.18
  Bottom 2.032: D405.A SL401.4 R404.P$2
ROW2
  Bottom 1.27: R403.P$2 133.99,43.81 133.99,50.8 133.35,51.44 AVR-LPC.19
  Bottom 2.032: R403.P$2 SL401.3 D406.A
ROW3
  Bottom 1.27: R402.P$2 135.89,46.35 AVR-LPC.20
  Bottom 2.032: D407.A SL401.2 R402.P$2
RS  (via drill 0.61 pad 6.35)
  Bottom 1.27: AVR-LPC.33 105.41,67.94 106.05,68.58 106.05,74.93 112.39,81.28 | 112.39,81.28 118.11,81.28 118.11,84.45 120.02,86.36 SL402.4 | v110.24,83.08 110.59,83.08 112.39,81.28
SCL
  Bottom 1.27: AVR-LPC.22 133.35,64.77 141.6,64.77 143.51,62.87 143.51,60.96 149.22,55.24 150.5,55.24 152.4,53.34 152.4,32.38 147.32,32.38 147.32,15.88 149.22,13.97 149.22,5.08 99.69,5.08 99.69,19.68 91.44,19.68 91.44,24.77 90.17,26.04 87.63,26.04 85.72,24.13 R302.P$1 85.72,6.91 85.17,6.91 X104.6
SDA
  Bottom 1.27: AVR-LPC.23 130.81,67.94 132.72,69.85 139.7,69.85 140.97,68.58 140.97,66.67 142.24,66.67 145.41,63.5 145.41,61.59 149.86,57.15 151.13,57.15 154.31,53.98 154.31,30.48 149.22,30.48 149.22,16.51 151.13,14.61 151.13,3.17 90.17,3.17 X104.7 89.53,6.99 88.9,7.62 R303.P$1
SEND_TO_PC
  Bottom 1.27: IC301.14 139.7,6.99 116.84,6.99 116.84,15.24 112.39,15.24 111.37,14.22 X301.2
TOSC1
  Bottom 2.032: C304.P$1 Q302.1 AVR-LPC.28
TOSC2
  Bottom 2.032: AVR-LPC.29 Q302.2 C305.P$1
(copper drawn outside any net)
  shapes: Route15 area x4, Route15 circle x2

### Text on the board
Top: AVR-LPC v.0.0.3 | 30.04.2011
Bottom: AVR-LPC v.0.0.3 | 01.11.2010
tNames: 1 | RP201 | RP202 | 1
tValues: 2K* | 2K* | TP_GND
Document: AREF | AVCC | +5V | SCL | SDA